# Altium project PLD.PrjPcb
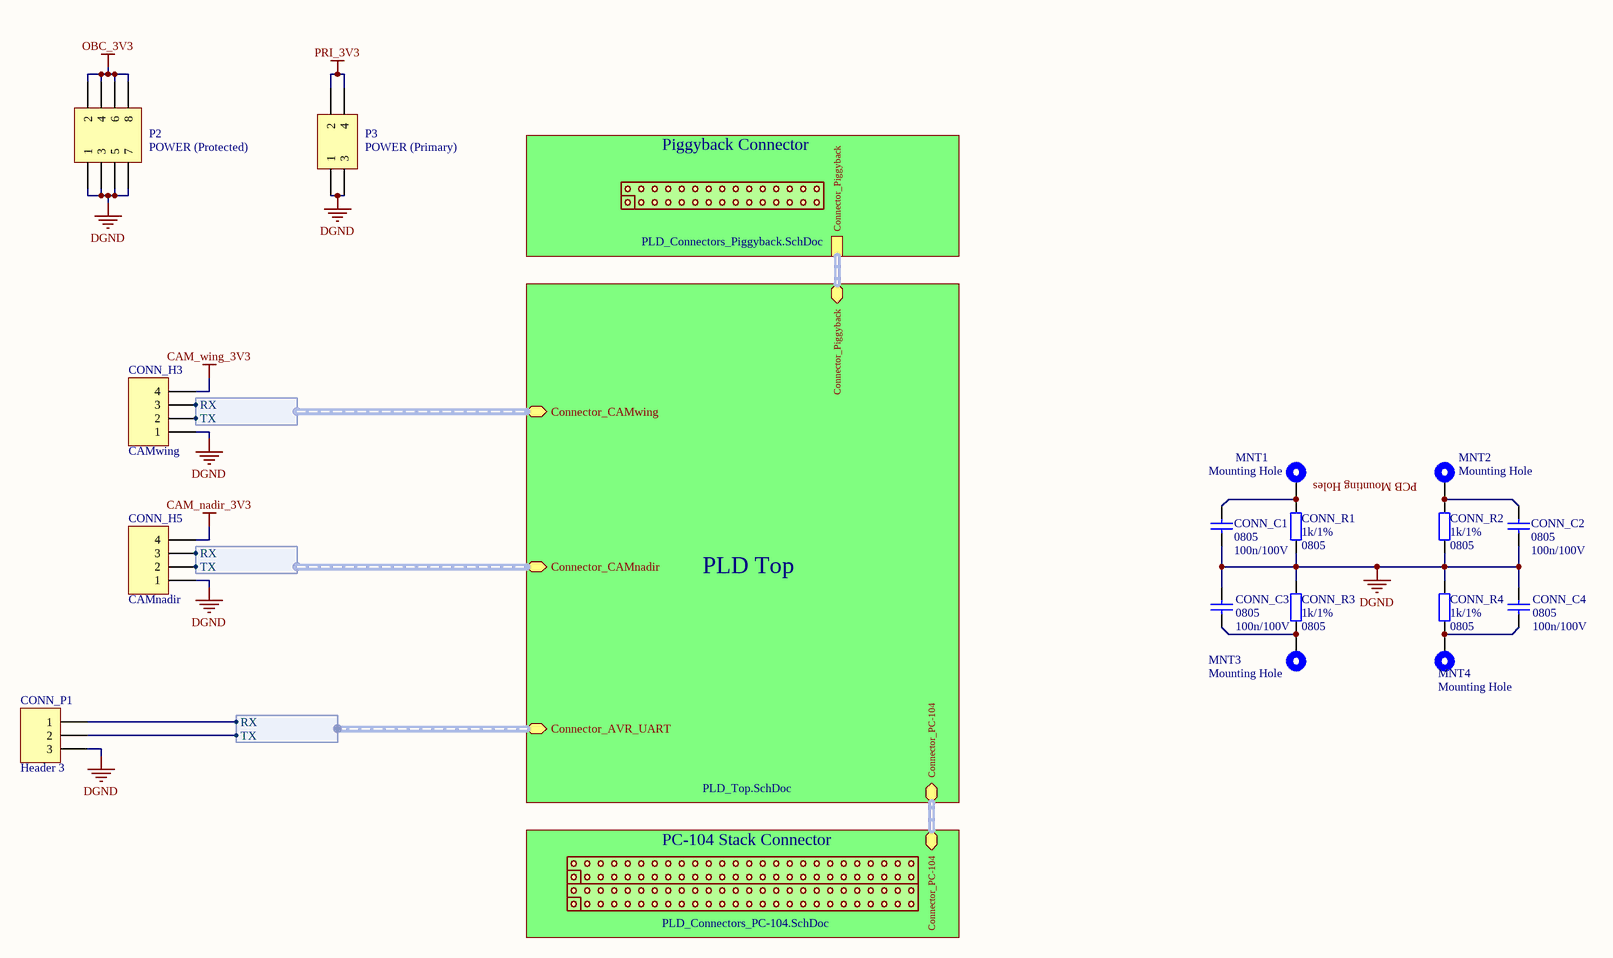
[diagram p0: PLD_Connectors.SchDoc]
ApprovedBy_Name: (not approved); Author_Name: M. Gumiela and  G. Gajoch; CheckedBy_Name: P. Kuligowski; Equipment: Main Board; Model: DM1; PCB_Author: (pcbdoc author); PCB_CheckedBy: (not checked); PCB_DocName: Main Board; PCB_DocNo: PWSat2-xxx-DW-xxx; PCB_Id: Main Board; PCB_Revision: 1; Project_FullName: PW-Sat2; Project_Id: PLD; Project_ShortName: PLD; Schematics_DocName: Main Board; Schematics_DocNo: PWSat2-xxx-DW-xxx; Schematics_Revision: 1; Subsystem: PLD
13 sheets, 154 parts. Net scope: hierarchical (ports join the sheet entries above them; power ports are global).
Board file: PLD.PcbDoc
Sheets:
  PLD_Connectors.SchDoc
    PLD Top = PLD_Top.SchDoc
      RTC = PLD_RTC.SchDoc
      AVR interface = AVR.SchDoc
      UART-Buffer&MUX for CAMs = PLD_CAM_MUX.SchDoc
      Gyroscopes = PLD_Gyroscopes.SchDoc
      Local Supply = PLD_Local-Supply.SchDoc
      Flash Memory 3 = PLD_Flash-Memory.SchDoc
      I2C Repeater for RTC + Gyro = PLD_I2C-Repeater.SchDoc
      FRAM Memory 1 = PLD_FRAM-Memory.SchDoc
      Flash Memory 2 = PLD_Flash-Memory.SchDoc
      Flash Memory 1 = PLD_Flash-Memory.SchDoc
      FRAM Memory 2 = PLD_FRAM-Memory.SchDoc
      FRAM Memory 3 = PLD_FRAM-Memory.SchDoc
      I2C_SW_Gyro = PLD_I2C_Switch.SchDoc
      I2C_SW_RTC = PLD_I2C_Switch.SchDoc
      I2C_SW_AVR = PLD_I2C_Switch.SchDoc
    PC-104 Stack Connector = PLD_Connectors_PC-104.SchDoc
    Piggyback Connector = PLD_Connectors_Piggyback.SchDoc

## Sheet PLD_Connectors.SchDoc: Connectors
size A3; ApprovedBy: Piotr Kuligowski; CheckedBy: Piotr Kuligowski; Author: Michał Gumiela; DocumentNumber: PWSat2-xxx-DW-xxx; Revision: 1; SheetNumber: 1; SheetTotal: 13; Model: DM1

### Parts
CONN_C1  Package: 0805  [SMD_Capacitor_0805]  (hidden comment: 100n/100V)
CONN_C2  Package: 0805  [SMD_Capacitor_0805]  (hidden comment: 100n/100V)
CONN_C3  Package: 0805  [SMD_Capacitor_0805]  (hidden comment: 100n/100V)
CONN_C4  Package: 0805  [SMD_Capacitor_0805]  (hidden comment: 100n/100V)
CONN_H3  CAMwing  [HEADER 1X4H Male]
CONN_H5  CAMnadir  [HEADER 1X4H Male]
CONN_P1  Header 3  [HEADER1X3H Male]
CONN_R1  Package: 0805  [SMD_Resistor_0805]  (hidden comment: 1k/1%)
CONN_R2  Package: 0805  [SMD_Resistor_0805]  (hidden comment: 1k/1%)
CONN_R3  Package: 0805  [SMD_Resistor_0805]  (hidden comment: 1k/1%)
CONN_R4  Package: 0805  [SMD_Resistor_0805]  (hidden comment: 1k/1%)
MNT1  Mounting Hole  [PC-104_PcbMntHole_M3]
MNT2  Mounting Hole  [PC-104_PcbMntHole_M3]
MNT3  Mounting Hole  [PC-104_PcbMntHole_M3]
MNT4  Mounting Hole  [PC-104_PcbMntHole_M3]
P2  POWER (Protected)  [HEADER 2X4 MALE]
P3  POWER (Primary)  [HDR2X2]

### Sub-sheets
PC-104 Stack Connector = PLD_Connectors_PC-104.SchDoc: Connector_PC-104 (harness Connector_PC-104)
Piggyback Connector = PLD_Connectors_Piggyback.SchDoc: Connector_Piggyback (harness Connector_Piggyback)
PLD Top = PLD_Top.SchDoc: Connector_PC-104 (harness Connector_PC-104), Connector_Piggyback (harness Connector_Piggyback), Connector_CAMnadir (harness CAM), Connector_CAMwing (harness CAM), Connector_AVR_UART (harness UART)

### Harnesses
CAM: TX, RX
UART: TX, RX

### Nets
CAM_nadir_3V3: CONN_H5.4
CAM_wing_3V3: CONN_H3.4
DGND: CONN_C1.1 CONN_C2.1 CONN_C3.2 CONN_C4.2 CONN_H3.1 CONN_H5.1 CONN_P1.3 CONN_R1.1 CONN_R2.1 CONN_R3.2 CONN_R4.2 P2.1 P2.3 P2.5 P2.7 P3.1 P3.3
OBC_3V3: P2.2 P2.4 P2.6 P2.8
PRI_3V3: P3.2 P3.4
NetCONN_C1_2: CONN_C1.2 CONN_R1.2 MNT1.1
NetCONN_C2_2: CONN_C2.2 CONN_R2.2 MNT2.1
NetCONN_C3_1: CONN_C3.1 CONN_R3.1 MNT3.1
NetCONN_C4_1: CONN_C4.1 CONN_R4.1 MNT4.1
NetCONN_H3_2: CONN_H3.2 ; sheet PLD Top/Connector_CAMwing.TX
NetCONN_H3_3: CONN_H3.3 ; sheet PLD Top/Connector_CAMwing.RX
NetCONN_H5_2: CONN_H5.2 ; sheet PLD Top/Connector_CAMnadir.TX
NetCONN_H5_3: CONN_H5.3 ; sheet PLD Top/Connector_CAMnadir.RX
NetCONN_P1_1: CONN_P1.1 ; sheet PLD Top/Connector_AVR_UART.RX
NetCONN_P1_2: CONN_P1.2 ; sheet PLD Top/Connector_AVR_UART.TX

### Buses and harness runs
harness sheet PC-104 Stack Connector/Connector_PC-104 = sheet PLD Top/Connector_PC-104
harness sheet Piggyback Connector/Connector_Piggyback = sheet PLD Top/Connector_Piggyback

### Notes on the sheet
- (near MNT1) PCB Mounting Holes
- Title:
- Project:
- Author:
- Model:
- Document Number:
- Checked by:
- Rev:
- Date:
- Approved by:
- Sheet:
- of
- File name:

### Library data of the parts
CONN_C1-CONN_C4 = Cer_C0805T104K1RCLTU: Ceramic Cap Kemet COTS 100n/100V X7R 0805; ManufacturerPartNumber: C0805T104K1RCLTU; Manufacturer: Kemet; Value: 100n/100V
CONN_H3 CONN_H5 = Header 4: Header, 4-Pin; LatestRevisionDate: 17-Jul-2002; LatestRevisionNote: Re-released for DXP Platform.; Publisher: Altium Limited
CONN_P1 = Header 3: Header, 3-Pin; LatestRevisionDate: 17-Jul-2002; LatestRevisionNote: Re-released for DXP Platform.; Publisher: Altium Limited
CONN_R1-CONN_R4 = CRCW08051K00FKxxxx: 1k/1% Vishay CRCW 0805 Resistor. 125mW, 100ppm, 150V.; Manufacturer: Vishay; ManufacturerPartNumber: CRCW08051K00FKxxxx; Value: 1k/1%
MNT1-MNT4 = MntHole: PCB Mounting Hole; Value: Mounting Hole
P2 = Header 4X2: Header, 4-Pin, Dual row; LatestRevisionDate: 17-Jul-2002; LatestRevisionNote: Re-released for DXP Platform.; Publisher: Altium Limited
P3 = Header 2X2: Header, 2-Pin, Dual row; LatestRevisionDate: 17-Jul-2002; LatestRevisionNote: Re-released for DXP Platform.; Publisher: Altium Limited

## Sheet PLD_Top.SchDoc: Top
size A4; ApprovedBy: Piotr Kuligowski; CheckedBy: Piotr Kuligowski; Author: Michał Gumiela; DocumentNumber: PWSat2-xxx-DW-xxx; Revision: 1; SheetNumber: 4; SheetTotal: 13; Model: DM1
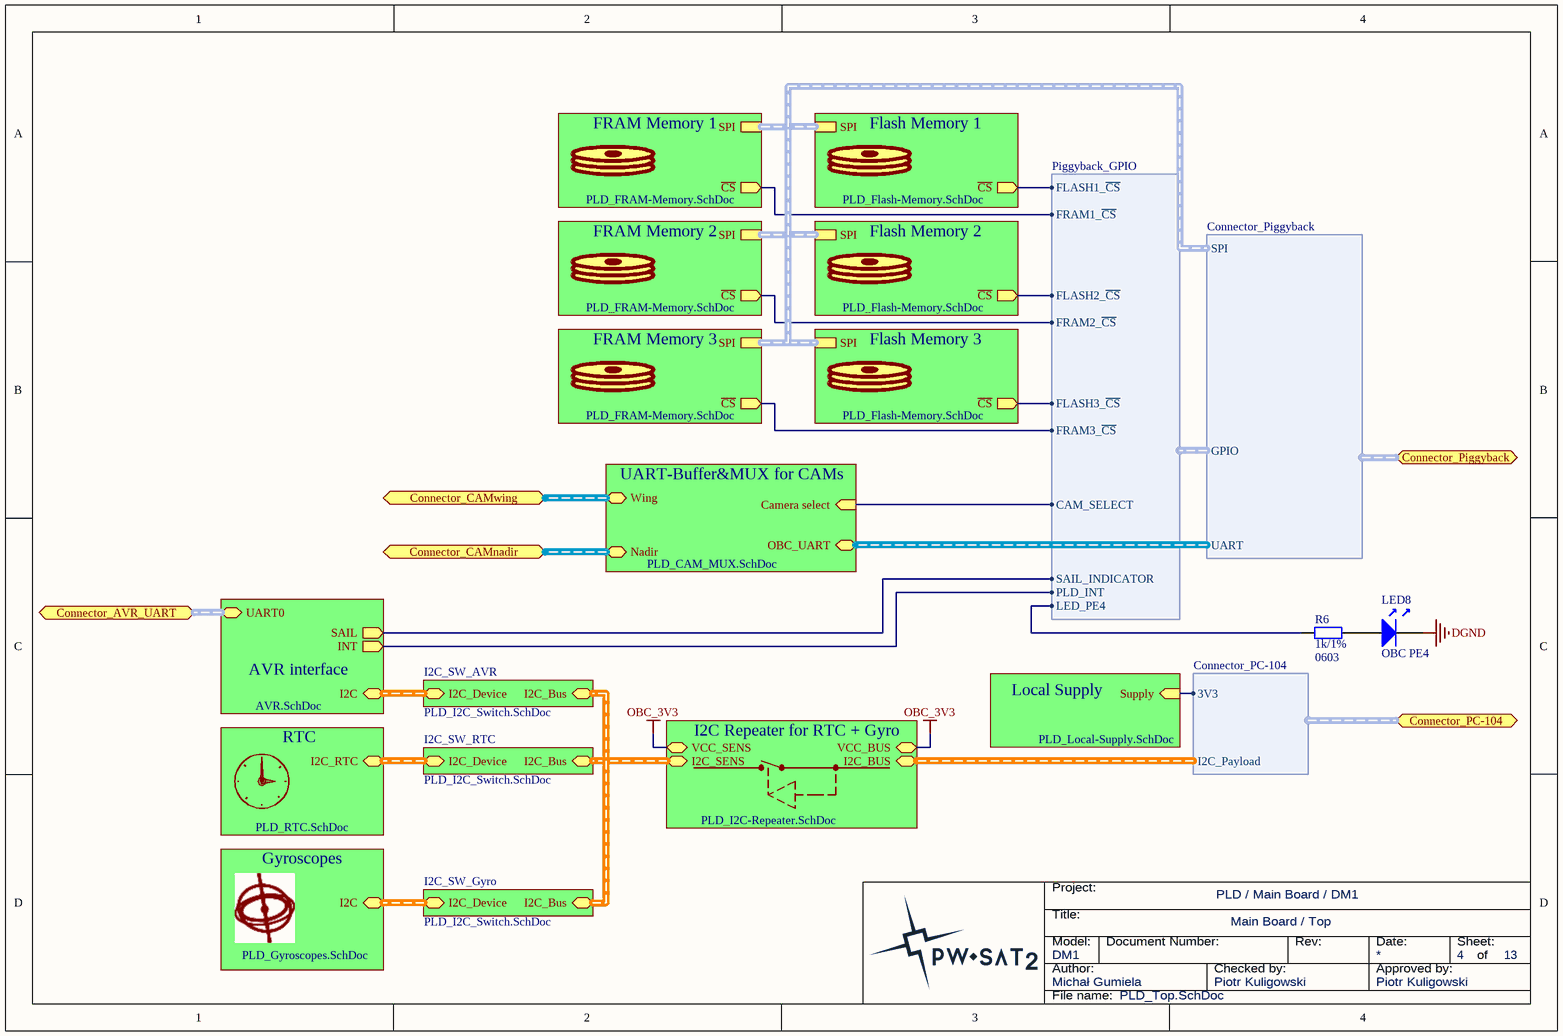
[diagram p1: PLD_Top.SchDoc]

### Parts
LED8  OBC PE4  [SMD_LED_1206]
R6  Package: 0603  [SMD_Resistor_0603]  (hidden comment: 1k/1%)

### Sub-sheets
AVR interface = AVR.SchDoc: I2C (harness I2C), INT (out), SAIL (out), UART0 (harness UART)
Flash Memory 1 = PLD_Flash-Memory.SchDoc: SPI (harness SPI), ~{CS} (out)
Flash Memory 2 = PLD_Flash-Memory.SchDoc: SPI (harness SPI), ~{CS} (out)
Flash Memory 3 = PLD_Flash-Memory.SchDoc: SPI (harness SPI), ~{CS} (out)
FRAM Memory 1 = PLD_FRAM-Memory.SchDoc: SPI (harness SPI), ~{CS} (out)
FRAM Memory 2 = PLD_FRAM-Memory.SchDoc: SPI (harness SPI), ~{CS} (out)
FRAM Memory 3 = PLD_FRAM-Memory.SchDoc: SPI (harness SPI), ~{CS} (out)
Gyroscopes = PLD_Gyroscopes.SchDoc: I2C (harness I2C)
I2C Repeater for RTC + Gyro = PLD_I2C-Repeater.SchDoc: I2C_BUS (harness I2C), VCC_SENS, VCC_BUS, I2C_SENS (harness I2C)
I2C_SW_AVR = PLD_I2C_Switch.SchDoc: I2C_Device (harness I2C), I2C_Bus (harness I2C)
I2C_SW_Gyro = PLD_I2C_Switch.SchDoc: I2C_Device (harness I2C), I2C_Bus (harness I2C)
I2C_SW_RTC = PLD_I2C_Switch.SchDoc: I2C_Device (harness I2C), I2C_Bus (harness I2C)
Local Supply = PLD_Local-Supply.SchDoc: Supply (in)
RTC = PLD_RTC.SchDoc: I2C_RTC (harness I2C)
UART-Buffer&MUX for CAMs = PLD_CAM_MUX.SchDoc: Camera select (in), OBC_UART (harness UART), Wing (harness CAM), Nadir (harness CAM)

### Ports
Connector_AVR_UART (harness UART), Connector_CAMnadir (harness Connector_CAM), Connector_CAMwing (harness Connector_CAM), Connector_PC-104 (harness Connector_PC-104), Connector_Piggyback (harness Connector_Piggyback)

### Harnesses
Connector_PC-104: I2C_Payload, 3V3
Connector_Piggyback: SPI, UART, GPIO
Piggyback_GPIO: CAM_SELECT, FLASH1_~{CS}, FRAM1_~{CS}, PLD_INT, FLASH2_~{CS}, FLASH3_~{CS}, FRAM2_~{CS}, FRAM3_~{CS}, SAIL_INDICATOR, LED_PE4

### Nets
DGND: LED8.K
OBC_3V3: sheet I2C Repeater for RTC + Gyro/VCC_SENS, sheet I2C Repeater for RTC + Gyro/VCC_BUS
INT: sheet AVR interface/INT, harness Piggyback_GPIO.PLD_INT
PC-104_Supply_OBC+3V3: sheet Local Supply/Supply, port Connector_PC-104.3V3
Piggyback_ADC_PD4: sheet AVR interface/SAIL, harness Piggyback_GPIO.SAIL_INDICATOR
Piggyback_GPIO_PA8: sheet Flash Memory 1/~{CS}, harness Piggyback_GPIO.FLASH1_~{CS}
Piggyback_GPIO_PA9: sheet Flash Memory 2/~{CS}, harness Piggyback_GPIO.FLASH2_~{CS}
Piggyback_GPIO_PA10: sheet Flash Memory 3/~{CS}, harness Piggyback_GPIO.FLASH3_~{CS}
Piggyback_GPIO_PA11: sheet FRAM Memory 1/~{CS}, harness Piggyback_GPIO.FRAM1_~{CS}
Piggyback_GPIO_PA12: sheet FRAM Memory 2/~{CS}, harness Piggyback_GPIO.FRAM2_~{CS}
Piggyback_GPIO_PA13: sheet FRAM Memory 3/~{CS}, harness Piggyback_GPIO.FRAM3_~{CS}
Piggyback_GPIO_PB12: sheet UART-Buffer&MUX for CAMs/Camera select, harness Piggyback_GPIO.CAM_SELECT
Piggyback_SPI-CS_PE4: R6.1 ; harness Piggyback_GPIO.LED_PE4
NetLED8_A: LED8.A R6.2

### Buses and harness runs
harness port Connector_AVR_UART = sheet AVR interface/UART0
harness port Connector_CAMnadir = sheet UART-Buffer&MUX for CAMs/Nadir
harness port Connector_CAMwing = sheet UART-Buffer&MUX for CAMs/Wing
harness sheet AVR interface/I2C = sheet I2C_SW_AVR/I2C_Device
harness sheet Flash Memory 1/SPI = sheet Flash Memory 2/SPI = sheet Flash Memory 3/SPI = sheet FRAM Memory 1/SPI = sheet FRAM Memory 2/SPI = sheet FRAM Memory 3/SPI
harness sheet Gyroscopes/I2C = sheet I2C_SW_Gyro/I2C_Device
harness sheet I2C Repeater for RTC + Gyro/I2C_SENS = sheet I2C_SW_AVR/I2C_Bus = sheet I2C_SW_Gyro/I2C_Bus = sheet I2C_SW_RTC/I2C_Bus
harness sheet I2C_SW_RTC/I2C_Device = sheet RTC/I2C_RTC

### Notes on the sheet
- Title:
- Project:
- Author:
- Model:
- Document Number:
- Checked by:
- Rev:
- Date:
- Approved by:
- Sheet:
- of
- File name:

### Library data of the parts
LED8 = LED-1206_RED: LED diode, SMD1206 package.; Value: OBC PE4; Supplier 1: Farnell; Farnell: 1581229
R6 = CRCW06031K00FKxxxx: 1k/1% Vishay CRCW 0603 Resistor. 100mW, 100ppm, 75V.; Manufacturer: Vishay; ManufacturerPartNumber: CRCW06031K00FKxxxx; Value: 1k/1%

## Sheet PLD_RTC.SchDoc: RTC
size A4; ApprovedBy: Piotr Kuligowski; CheckedBy: Piotr Kuligowski; Author: Michał Gumiela; DocumentNumber: PWSat2-xxx-DW-xxx; Revision: 1; SheetNumber: 11; SheetTotal: 13; Model: DM1
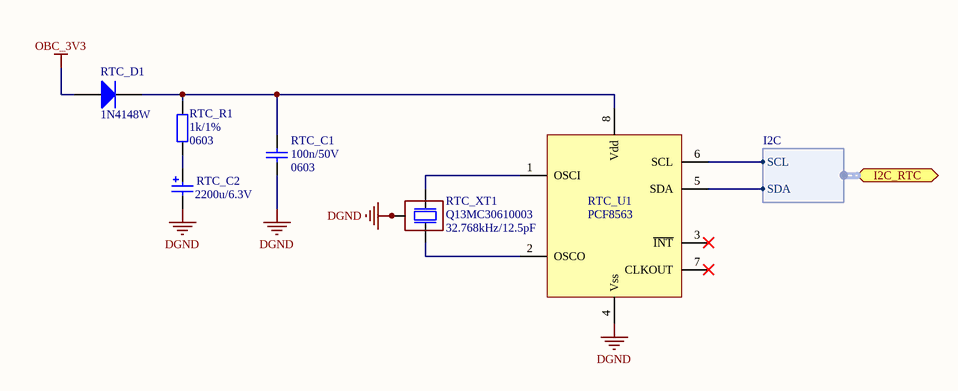
[diagram p2: PLD_RTC.SchDoc]

### Parts
RTC_C1  Package: 0603  [SMD_Capacitor_0603]  (hidden comment: 100n/50V)
RTC_C2  2200u/6.3V  [Tant_592D_X]
RTC_D1  1N4148W  [SOD-123]
RTC_R1  Package: 0603  [SMD_Resistor_0603]  (hidden comment: 1k/1%)
RTC_U1  (no value)  [TSSOP8_L]
RTC_XT1  32.768kHz/12.5pF  [Epson_MC-306]

### Ports
I2C_RTC (harness I2C)

### Harnesses
I2C: SDA, SCL

### Nets
DGND: RTC_C1.2 RTC_C2.2 RTC_U1.4(Vss) RTC_XT1.2(NC) RTC_XT1.3(NC)
OBC_3V3: RTC_D1.A
NetI2C_SW_R1_I2C_SW_RTC_2: RTC_U1.5(SDA) ; port I2C_RTC.SDA
NetI2C_SW_R2_I2C_SW_RTC_2: RTC_U1.6(SCL) ; port I2C_RTC.SCL
NetRTC_C1_1: RTC_C1.1 RTC_D1.K RTC_R1.1 RTC_U1.8(Vdd)
NetRTC_C2_1: RTC_C2.1 RTC_R1.2
NetRTC_U1_1: RTC_U1.1(OSCI) RTC_XT1.1(inp)
NetRTC_U1_2: RTC_U1.2(OSCO) RTC_XT1.4(out)

Not connected (* = marked no-connect by the designer): RTC_U1 3(~{INT})* 7(CLKOUT)*

### Notes on the sheet
- Title:
- Project:
- Author:
- Model:
- Document Number:
- Checked by:
- Rev:
- Date:
- Approved by:
- Sheet:
- of
- File name:

### Library data of the parts
RTC_C1 = Cer_C0603T104K5RALTU: Ceramic Cap Kemet COTS 100n/50V X7R 0603; Manufacturer: Kemet; ManufacturerPartNumber: C0603T104K5RALTU; Value: 100n/50V
RTC_C2 = Tant_592D228X96R3X2T20H: Vishay 592D Solid Tantalum Chip Capacitors.; ManufacturerPartNumber: 592D228X96R3X2T20H; Manufacturer: Vishay; Value: 2200u/6.3V
RTC_D1 = 1N4148W: Small Signal Fast Switching Diode; Manufacturer: Vishay; Value: 1N4148W
RTC_R1 = CRCW06031K00FKxxxx: as R6 on sheet PLD_Top; Manufacturer: Vishay; ManufacturerPartNumber: CRCW06031K00FKxxxx; Value: 1k/1%
RTC_U1 = PCF8563: Real-time clock/calendar; Manufacturer: NXP; HelpUrl: http://www.nxp.com/documents/data_sheet/PCF8563.pdf; ManufacturerPartNumber: PCF8563
RTC_XT1 = Q13MC30610003: EPSON MC-306 32.768KHZ 12.5pF Crystal; Manufacturer: Epson; ManufacturerPartNumber: Q13MC30610003; Value: 32.768kHz/12.5pF

## Sheet AVR.SchDoc: Gyroscopes Buffer
size A4; ApprovedBy: Piotr Kuligowski; CheckedBy: Piotr Kuligowski; Author: Michał Gumiela; DocumentNumber: PWSat2-xxx-DW-xxx; Revision: 1; SheetNumber: 10; SheetTotal: 13; Model: DM1
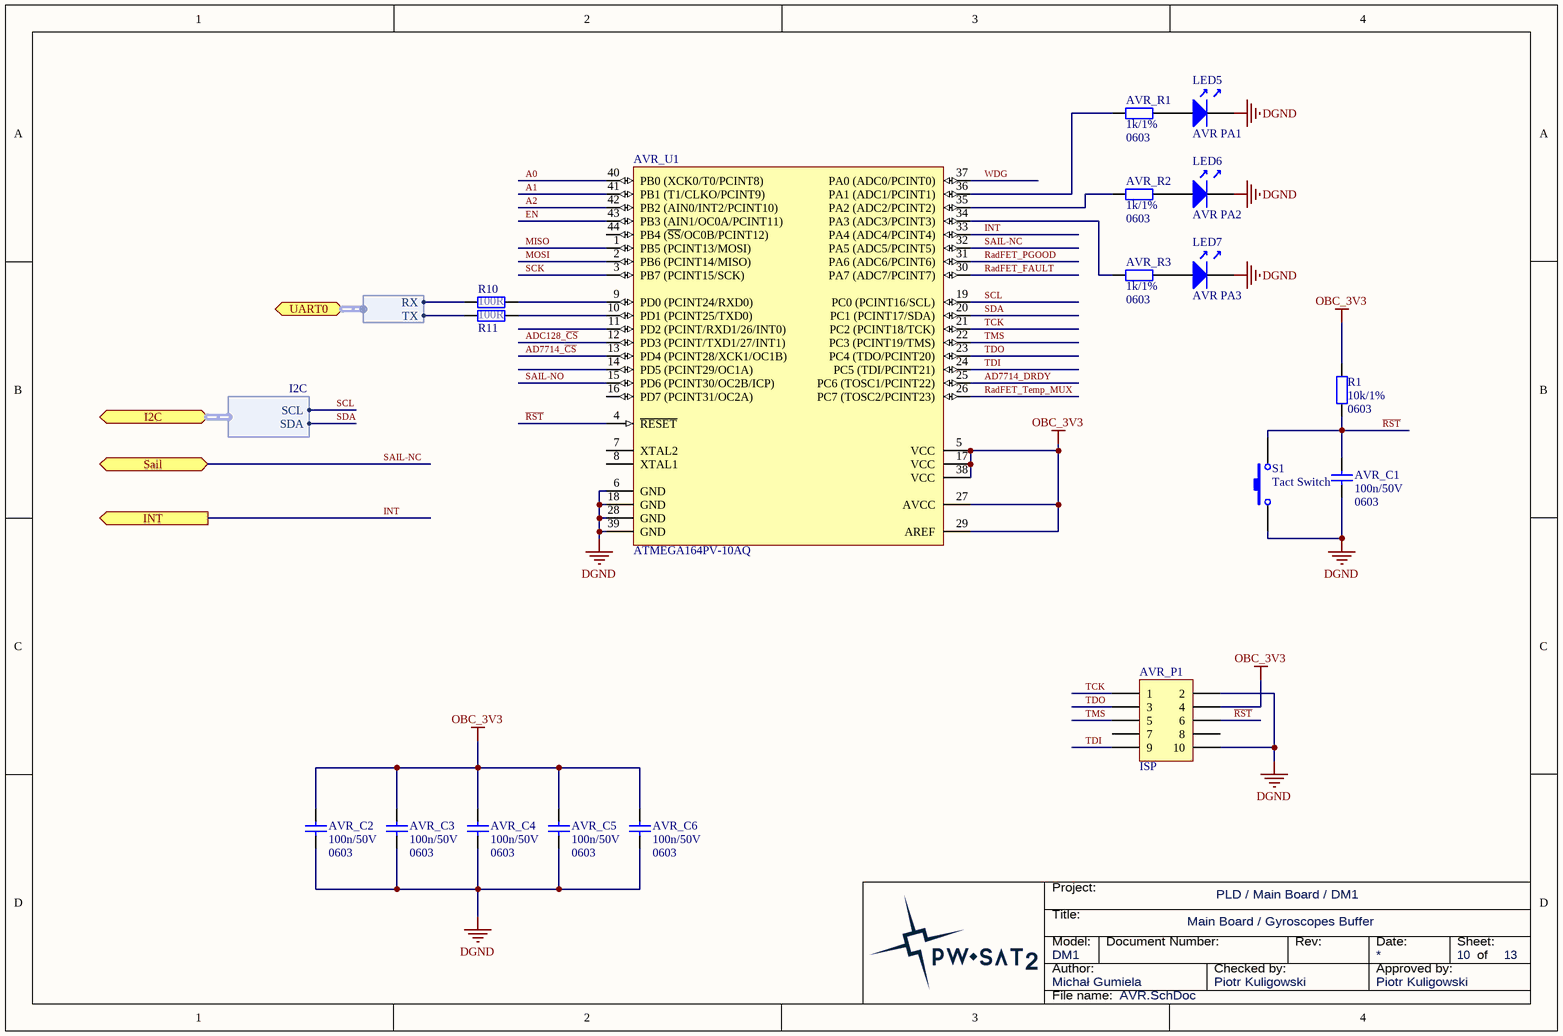
[diagram p3: AVR.SchDoc]

### Parts
AVR_C1  Package: 0603  [SMD_Capacitor_0603]  (hidden comment: 100n/50V)
AVR_C2  Package: 0603  [SMD_Capacitor_0603]  (hidden comment: 100n/50V)
AVR_C3  Package: 0603  [SMD_Capacitor_0603]  (hidden comment: 100n/50V)
AVR_C4  Package: 0603  [SMD_Capacitor_0603]  (hidden comment: 100n/50V)
AVR_C5  Package: 0603  [SMD_Capacitor_0603]  (hidden comment: 100n/50V)
AVR_C6  Package: 0603  [SMD_Capacitor_0603]  (hidden comment: 100n/50V)
AVR_P1  ISP  [IDC-10-Male-Socket]
AVR_R1  Package: 0603  [SMD_Resistor_0603]  (hidden comment: 1k/1%)
AVR_R2  Package: 0603  [SMD_Resistor_0603]  (hidden comment: 1k/1%)
AVR_R3  Package: 0603  [SMD_Resistor_0603]  (hidden comment: 1k/1%)
AVR_U1  ATMEGA164PV-10AQ  [TQFP-44]
LED5  AVR PA1  [SMD_LED_1206]
LED6  AVR PA2  [SMD_LED_1206]
LED7  AVR PA3  [SMD_LED_1206]
R1  Package: 0603  [SMD_Resistor_0603]  (hidden comment: 10k/1%)
R10  100R  [SMD_Resistor_0603]
R11  100R  [SMD_Resistor_0603]
S1  Tact Switch  [Tact Switch 3x6]

### Ports
I2C (harness I2C), INT (out), Sail, UART0 (harness UART)

### Harnesses
I2C: SDA, SCL
UART: TX, RX

### Nets
DGND: AVR_C1.2 AVR_C2.2 AVR_C3.2 AVR_C4.2 AVR_C5.2 AVR_C6.2 AVR_P1.2 AVR_P1.10 AVR_U1.6(GND) AVR_U1.18(GND) AVR_U1.28(GND) AVR_U1.39(GND) LED5.K LED6.K LED7.K S1.2
OBC_3V3: AVR_C2.1 AVR_C3.1 AVR_C4.1 AVR_C5.1 AVR_C6.1 AVR_P1.4 AVR_U1.5(VCC) AVR_U1.17(VCC) AVR_U1.27(AVCC) AVR_U1.29(AREF) AVR_U1.38(VCC) R1.1
A0: AVR_U1.40(PB0_(XCK0/T0/PCINT8))
A1: AVR_U1.41(PB1_(T1/CLKO/PCINT9))
A2: AVR_U1.42(PB2_(AIN0/INT2/PCINT10))
AD7714_~{CS}: AVR_U1.13(PD4_(PCINT28/XCK1/OC1B))
AD7714_DRDY: AVR_U1.25(PC6_(TOSC1/PCINT22))
ADC128_~{CS}: AVR_U1.12(PD3_(PCINT/TXD1/27/INT1))
EN: AVR_U1.43(PB3_(AIN1/OC0A/PCINT11))
INT: AVR_U1.33(PA4_(ADC4/PCINT4)) ; port INT
MISO: AVR_U1.1(PB5_(PCINT13/MOSI))
MOSI: AVR_U1.2(PB6_(PCINT14/MISO))
~{RST}: AVR_C1.1 AVR_P1.6 AVR_U1.4(~{RESET}) R1.2 S1.1
RadFET_FAULT: AVR_U1.30(PA7_(ADC7/PCINT7))
RadFET_PGOOD: AVR_U1.31(PA6_(ADC6/PCINT6))
RadFET_Temp_MUX: AVR_U1.26(PC7_(TOSC2/PCINT23))
SAIL-NC: AVR_U1.32(PA5_(ADC5/PCINT5)) ; port Sail  [project net Piggyback_ADC_PD4]
SAIL-NO: AVR_U1.15(PD6_(PCINT30/OC2B/ICP))
SCK: AVR_U1.3(PB7_(PCINT15/SCK))
SCL: AVR_U1.19(PC0_(PCINT16/SCL)) ; port I2C.SCL
SDA: AVR_U1.20(PC1_(PCINT17/SDA)) ; port I2C.SDA
TCK: AVR_P1.1 AVR_U1.21(PC2_(PCINT18/TCK))
TDI: AVR_P1.9 AVR_U1.24(PC5_(TDI/PCINT21))
TDO: AVR_P1.3 AVR_U1.23(PC4_(TDO/PCINT20))
TMS: AVR_P1.5 AVR_U1.22(PC3_(PCINT19/TMS))
WDG: AVR_U1.37(PA0_(ADC0/PCINT0))
NetAVR_R1_1: AVR_R1.1 AVR_U1.36(PA1_(ADC1/PCINT1))
NetAVR_R1_2: AVR_R1.2 LED5.A
NetAVR_R2_1: AVR_R2.1 AVR_U1.35(PA2_(ADC2/PCINT2))
NetAVR_R2_2: AVR_R2.2 LED6.A
NetAVR_R3_1: AVR_R3.1 AVR_U1.34(PA3_(ADC3/PCINT3))
NetAVR_R3_2: AVR_R3.2 LED7.A
NetAVR_U1_9: AVR_U1.9(PD0_(PCINT24/RXD0)) R10.2
NetAVR_U1_10: AVR_U1.10(PD1_(PCINT25/TXD0)) R11.2
NetCONN_P1_1: R10.1 ; port UART0.RX
NetCONN_P1_2: R11.1 ; port UART0.TX

Not connected (* = marked no-connect by the designer): AVR_P1 7 8; AVR_U1 7(XTAL2) 8(XTAL1) 11(PD2_(PCINT/RXD1/26/INT0)) 14(PD5_(PCINT29/OC1A)) 16(PD7_(PCINT31/OC2A)) 44(PB4_(~{SS}/OC0B/PCINT12))

### Notes on the sheet
- Title:
- Project:
- Author:
- Model:
- Document Number:
- Checked by:
- Rev:
- Date:
- Approved by:
- Sheet:
- of
- File name:

### Library data of the parts
AVR_C1-AVR_C6 = Cer_C0603T104K5RALTU: Ceramic Cap Kemet COTS 100n/50V X7R 0603; Manufacturer: Kemet; ManufacturerPartNumber: C0603T104K5RALTU; Value: 100n/50V
AVR_P1 = Header 5X2: Header, 5-Pin, Dual row
AVR_R1-AVR_R3 = CRCW06031K00FKxxxx: as R6 on sheet PLD_Top; Manufacturer: Vishay; ManufacturerPartNumber: CRCW06031K00FKxxxx; Value: 1k/1%
AVR_U1 = ATMEGA164PV-10AQ: General-purpose microcontroller; Value: ATMEGA164PV-10AQ
LED5-LED7 = LED-1206_RED: LED diode, SMD1206 package.; Supplier 1: Farnell; Farnell: 1581229
  LED5: Value: AVR PA1
  LED6: Value: AVR PA2
  LED7: Value: AVR PA3
R1 R10 R11 = CRCW060310K0FKxxxx: 10k/1% Vishay CRCW 0603 Resistor. 100mW, 100ppm, 75V.; Manufacturer: Vishay; ManufacturerPartNumber: CRCW060310K0FKxxxx
  R1: Value: 10k/1%
  R10 R11: Value: 100R; Package: 0603
S1 = TactSwitch: Supplier 1: Farnell

## Sheet PLD_CAM_MUX.SchDoc: CAMs UART-Buffer
size A4; ApprovedBy: Piotr Kuligowski; CheckedBy: Piotr Kuligowski; Author: Michał Gumiela; DocumentNumber: PWSat2-xxx-DW-xxx; Revision: 1; SheetNumber: 9; SheetTotal: 13; Model: DM1
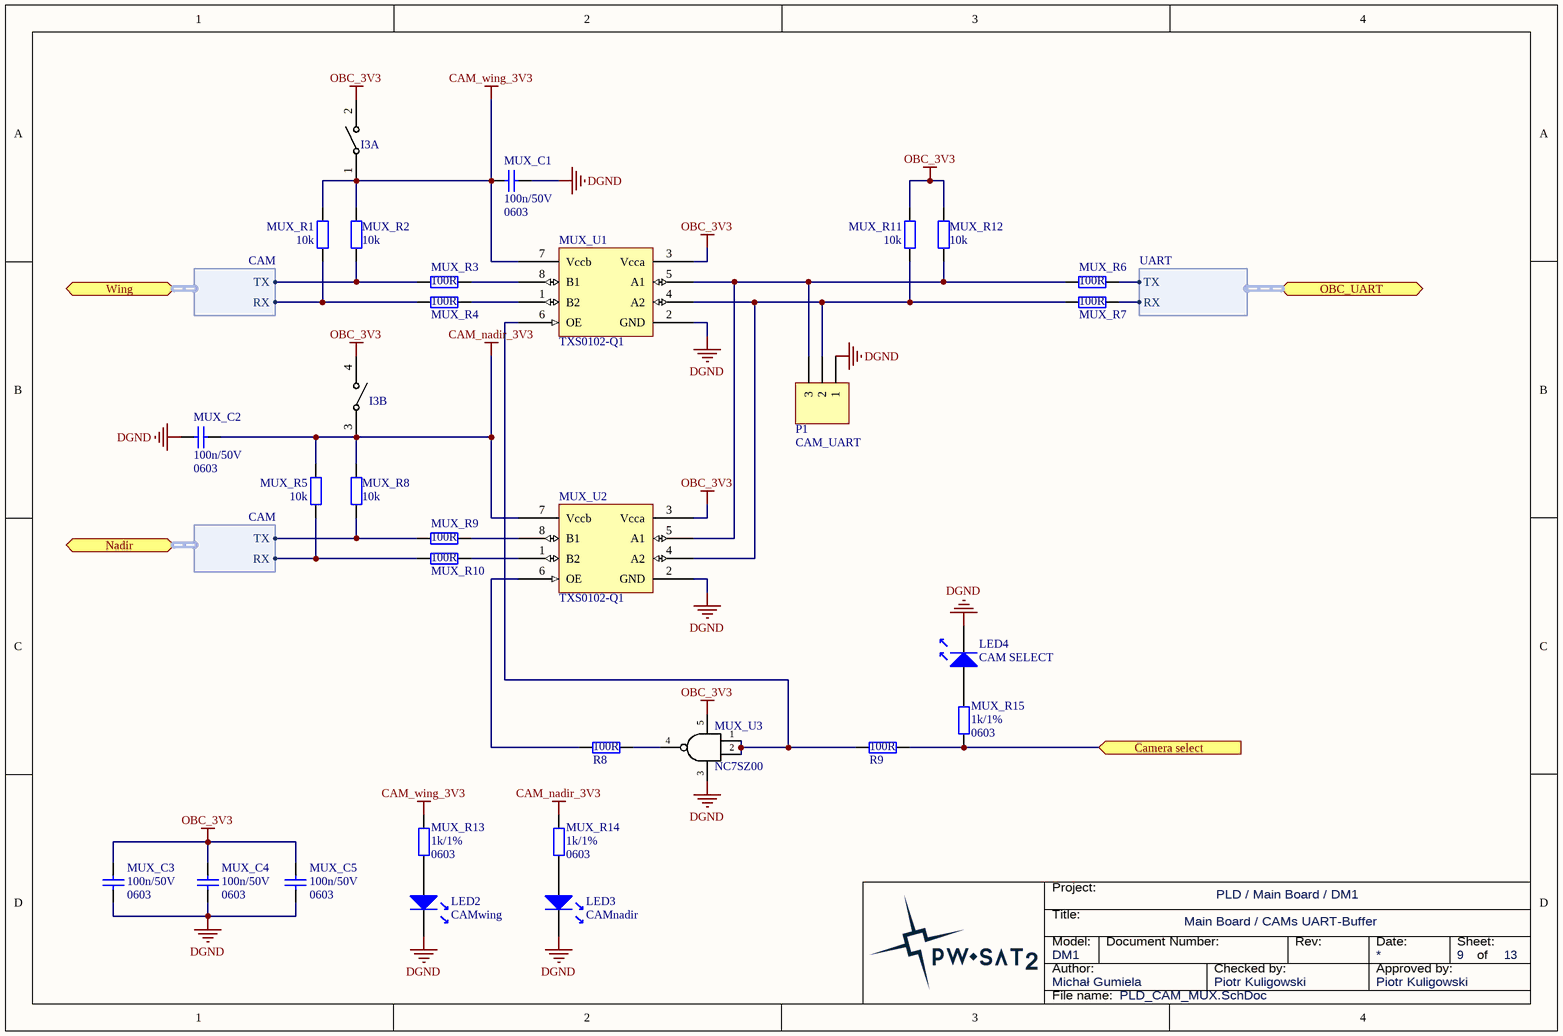
[diagram p4: PLD_CAM_MUX.SchDoc]

### Parts
I3  MCEPM-02  [MCEPM-02]  (value not drawn)  (parts A,B of 2)
LED2  CAMwing  [SMD_LED_1206]
LED3  CAMnadir  [SMD_LED_1206]
LED4  CAM SELECT  [SMD_LED_1206]
MUX_C1  Package: 0603  [SMD_Capacitor_0603]  (hidden comment: 100n/50V)
MUX_C2  Package: 0603  [SMD_Capacitor_0603]  (hidden comment: 100n/50V)
MUX_C3  Package: 0603  [SMD_Capacitor_0603]  (hidden comment: 100n/50V)
MUX_C4  Package: 0603  [SMD_Capacitor_0603]  (hidden comment: 100n/50V)
MUX_C5  Package: 0603  [SMD_Capacitor_0603]  (hidden comment: 100n/50V)
MUX_R1  10k  [SMD_Resistor_0603]
MUX_R2  10k  [SMD_Resistor_0603]
MUX_R3  100R  [SMD_Resistor_0603]
MUX_R4  100R  [SMD_Resistor_0603]
MUX_R5  10k  [SMD_Resistor_0603]
MUX_R6  100R  [SMD_Resistor_0603]
MUX_R7  100R  [SMD_Resistor_0603]
MUX_R8  10k  [SMD_Resistor_0603]
MUX_R9  100R  [SMD_Resistor_0603]
MUX_R10  100R  [SMD_Resistor_0603]
MUX_R11  10k  [SMD_Resistor_0603]
MUX_R12  10k  [SMD_Resistor_0603]
MUX_R13  Package: 0603  [SMD_Resistor_0603]  (hidden comment: 1k/1%)
MUX_R14  Package: 0603  [SMD_Resistor_0603]  (hidden comment: 1k/1%)
MUX_R15  Package: 0603  [SMD_Resistor_0603]  (hidden comment: 1k/1%)
MUX_U1  TXS0102-Q1  [VSSOP-8]
MUX_U2  TXS0102-Q1  [VSSOP-8]
MUX_U3  NC7SZ00  [SOT23-5]
P1  CAM_UART  [HEADER 1X3 MALE]
R8  100R  [SMD_Resistor_0603]
R9  100R  [SMD_Resistor_0603]

### Ports
Camera select (in), Nadir (harness CAM), OBC_UART (harness UART), Wing (harness CAM)

### Harnesses
UART: RX, TX
CAM: TX, RX

### Nets
CAM_nadir_3V3: I3.3 MUX_C2.1 MUX_R5.2 MUX_R8.2 MUX_R14.1 MUX_U2.7(Vccb)
CAM_wing_3V3: I3.1 MUX_C1.1 MUX_R1.2 MUX_R2.2 MUX_R13.1 MUX_U1.7(Vccb)
DGND: LED2.K LED3.K LED4.K MUX_C1.2 MUX_C2.2 MUX_C3.2 MUX_C4.2 MUX_C5.2 MUX_U1.2(GND) MUX_U2.2(GND) MUX_U3.3(GND) P1.1
OBC_3V3: I3.2 I3.4 MUX_C3.1 MUX_C4.1 MUX_C5.1 MUX_R11.2 MUX_R12.2 MUX_U1.3(Vcca) MUX_U2.3(Vcca) MUX_U3.5(Vcc)
Piggyback_GPIO_PB12: MUX_R15.1 R9.2 ; port Camera select
Piggyback_UART-RX_PF7: MUX_R7.2 ; port OBC_UART.RX
Piggyback_UART-TX_PF6: MUX_R6.2 ; port OBC_UART.TX
NetCONN_H3_2: MUX_R2.1 MUX_R3.1 ; port Wing.TX
NetCONN_H3_3: MUX_R1.1 MUX_R4.1 ; port Wing.RX
NetCONN_H5_2: MUX_R8.1 MUX_R9.1 ; port Nadir.TX
NetCONN_H5_3: MUX_R5.1 MUX_R10.1 ; port Nadir.RX
NetLED2_A: LED2.A MUX_R13.2
NetLED3_A: LED3.A MUX_R14.2
NetLED4_A: LED4.A MUX_R15.2
NetMUX_R3_2: MUX_R3.2 MUX_U1.8(B1)
NetMUX_R4_2: MUX_R4.2 MUX_U1.1(B2)
NetMUX_R6_1: MUX_R6.1 MUX_R12.1 MUX_U1.5(A1) MUX_U2.5(A1) P1.3
NetMUX_R7_1: MUX_R7.1 MUX_R11.1 MUX_U1.4(A2) MUX_U2.4(A2) P1.2
NetMUX_R9_2: MUX_R9.2 MUX_U2.8(B1)
NetMUX_R10_2: MUX_R10.2 MUX_U2.1(B2)
NetMUX_U1_6: MUX_U1.6(OE) MUX_U3.1(A) MUX_U3.2(B) R9.1
NetMUX_U2_6: MUX_U2.6(OE) R8.1
NetMUX_U3_4: MUX_U3.4(Y) R8.2

### Notes on the sheet
- Title:
- Project:
- Author:
- Model:
- Document Number:
- Checked by:
- Rev:
- Date:
- Approved by:
- Sheet:
- of
- File name:

### Library data of the parts
LED2-LED4 = LED-1206_RED: LED diode, SMD1206 package.; Supplier 1: Farnell; Farnell: 1581229
  LED2: Value: CAMwing
  LED3: Value: CAMnadir
  LED4: Value: CAM SELECT
MUX_C1-MUX_C5 = Cer_C0603T104K5RALTU: Ceramic Cap Kemet COTS 100n/50V X7R 0603; Manufacturer: Kemet; ManufacturerPartNumber: C0603T104K5RALTU; Value: 100n/50V
MUX_R1-MUX_R12 R8 R9 = Res: Package: 0603
  MUX_R1 MUX_R2 MUX_R5 MUX_R8 MUX_R11 MUX_R12: Value: 10k
  MUX_R3 MUX_R4 MUX_R6 MUX_R7 MUX_R9 MUX_R10 R8 R9: Value: 100R
MUX_R13-MUX_R15 = CRCW06031K00FKxxxx: as R6 on sheet PLD_Top; Manufacturer: Vishay; ManufacturerPartNumber: CRCW06031K00FKxxxx; Value: 1k/1%
MUX_U1 MUX_U2 = TXS0102-Q1: 2-Bit Bidirectional Voltage-Level Translator  for Open-Drain and Push-Pull Applications; Manufacturer: Texas Instruments; Value: TXS0102-Q1; ComponentLink1URL: http://www.ti.com/lit/ds/symlink/txs0102-q1.pdf; ComponentLink1Description: Description; HelpURL: http://www.ti.com/lit/ds/symlink/txs0102-q1.pdf
MUX_U3 = NC7SZ00: TinyLogic UHS Two-Input NAND Gate.; Manufacturer: Fairchild Semiconductor; Value: NC7SZ00
P1 = Header 3: Header, 3-Pin; LatestRevisionDate: 17-Jul-2002; LatestRevisionNote: Re-released for DXP Platform.; Publisher: Altium Limited
I3 = MCEPM-02: Supplier 1: Farnell

## Sheet PLD_Gyroscopes.SchDoc: Gyroscopes
size A4; ApprovedBy: Piotr Kuligowski; CheckedBy: Piotr Kuligowski; Author: Michał Gumiela; DocumentNumber: PWSat2-xxx-DW-xxx; Revision: 1; SheetNumber: 6; SheetTotal: 13; Model: DM1
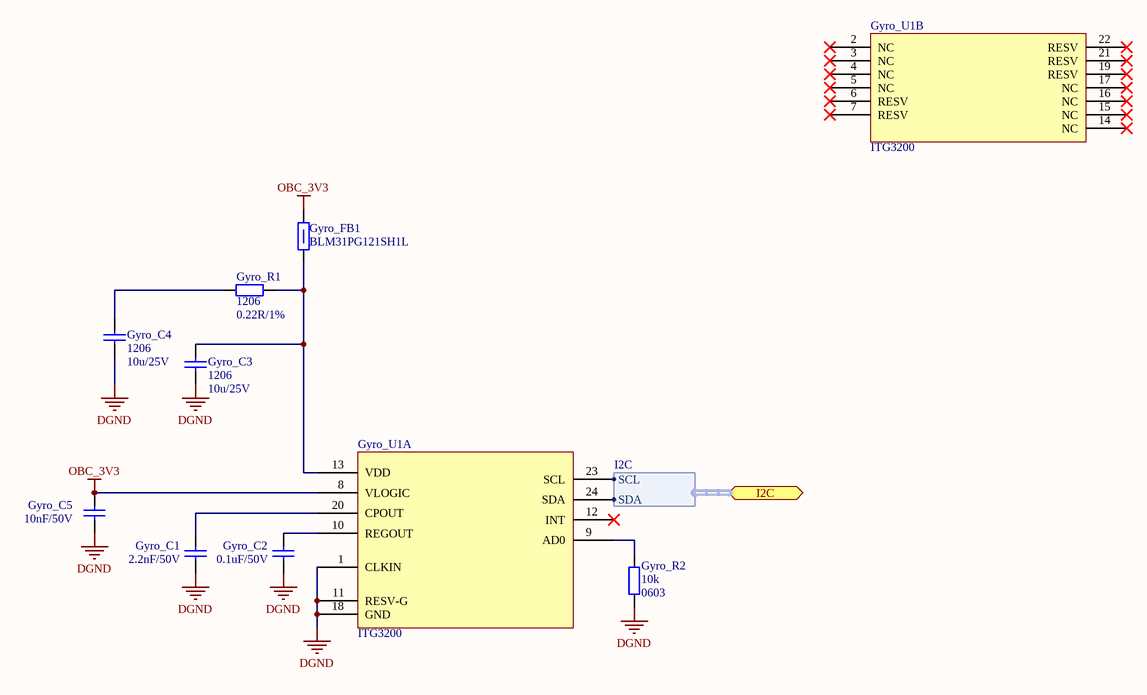
[diagram p5: PLD_Gyroscopes.SchDoc]

### Parts
Gyro_C1  2.2nF/50V  [SMD_Capacitor_0603]
Gyro_C2  0.1uF/50V  [SMD_Capacitor_0603]
Gyro_C3  Package: 1206  [SMD_Capacitor_1206]  (hidden comment: 10u/25V)
Gyro_C4  Package: 1206  [SMD_Capacitor_1206]  (hidden comment: 10u/25V)
Gyro_C5  10nF/50V  [SMD_Capacitor_0603]
Gyro_FB1  120R/100MHz  [SMD_FerriteBead_1206]  (value not drawn)
Gyro_R1  Package: 1206  [SMD_Resistor_1206]  (hidden comment: 0.22R/1%)
Gyro_R2  10k  Package: 0603  [SMD_Resistor_0603]
Gyro_U1  ITG3200  [QFN24_4x4]  (parts A,B of 2)

### Ports
I2C (harness I2C)

### Harnesses
I2C: SDA, SCL

### Nets
DGND: Gyro_C1.2 Gyro_C2.2 Gyro_C3.2 Gyro_C4.2 Gyro_C5.2 Gyro_R2.2 Gyro_U1.1(CLKIN) Gyro_U1.11(RESV-G) Gyro_U1.18(GND)
OBC_3V3: Gyro_C5.1 Gyro_FB1.1 Gyro_U1.8(VLOGIC)
NetGyro_C1_1: Gyro_C1.1 Gyro_U1.20(CPOUT)
NetGyro_C2_1: Gyro_C2.1 Gyro_U1.10(REGOUT)
NetGyro_C3_1: Gyro_C3.1 Gyro_FB1.2 Gyro_R1.2 Gyro_U1.13(VDD)
NetGyro_C4_1: Gyro_C4.1 Gyro_R1.1
NetGyro_R2_1: Gyro_R2.1 Gyro_U1.9(AD0)
NetGyro_U1_23: Gyro_U1.23(SCL) ; port I2C.SCL
NetGyro_U1_24: Gyro_U1.24(SDA) ; port I2C.SDA

Not connected (* = marked no-connect by the designer): Gyro_U1 2(NC)* 3(NC)* 4(NC)* 5(NC)* 6(RESV)* 7(RESV)* 12(INT)* 14(NC)* 15(NC)* 16(NC)* 17(NC)* 19(RESV)* 21(RESV)* 22(RESV)*

### Notes on the sheet
- Title:
- Project:
- Author:
- Model:
- Document Number:
- Checked by:
- Rev:
- Date:
- Approved by:
- Sheet:
- of
- File name:

### Library data of the parts
Gyro_C1 Gyro_C2 Gyro_C5 = Cer_C0603T104K5RALTU: Ceramic Cap Kemet COTS 100n/50V X7R 0603; Manufacturer: Kemet; ManufacturerPartNumber: C0603T104K5RALTU; Package: 0603
  Gyro_C1: Value: 2.2nF/50V
  Gyro_C2: Value: 0.1uF/50V
  Gyro_C5: Value: 10nF/50V
Gyro_C3 Gyro_C4 = Cer_C1206T105K3RALTU: Ceramic Cap Kemet COTS 1u/25V X7R 1206; ManufacturerPartNumber: C1206T105K3RALTU; Manufacturer: Kemet; Value: 10u/25V
Gyro_FB1 = BLM31PG121SH1L: Ferrite bead, 1206, 0.02HM, 3.5A.; Manufacturer: Murata; Current Rating: 3.5A; Series Resistance DC: 0.02R; Package: 1206; Value: 120R/100MHz; ManufacturerPartNumber: BLM31PG121SH1L
Gyro_R1 = ERJ-8BQFR22V: Panasonic Resistor 0.22R 1% 1206 330mW; Manufacturer: Panasonic; ManufacturerPartNumber: ERJ-8BQFR22V; Value: 0.22R/1%
Gyro_R2 = Res: Value: Res

## Sheet PLD_Local-Supply.SchDoc: Local Supply
size A4; ApprovedBy: Piotr Kuligowski; CheckedBy: Piotr Kuligowski; Author: Michał Gumiela; DocumentNumber: PWSat2-xxx-DW-xxx; Revision: 1; SheetNumber: 5; SheetTotal: 13; Model: DM1
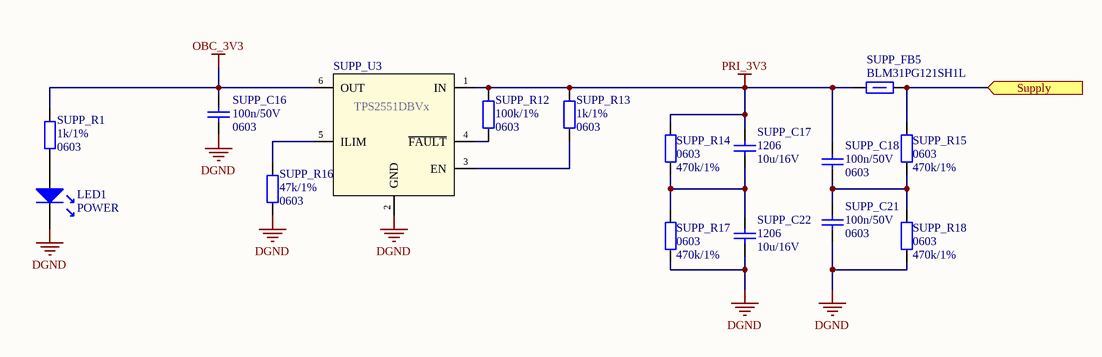
[diagram p6: PLD_Local-Supply.SchDoc]

### Parts
LED1  POWER  [SMD_LED_1206]
SUPP_C16  Package: 0603  [SMD_Capacitor_0603]  (hidden comment: 100n/50V)
SUPP_C17  Packge: 1206  [SMD_Capacitor_1206]  (hidden comment: 10u/16V)
SUPP_C18  Package: 0603  [SMD_Capacitor_0603]  (hidden comment: 100n/50V)
SUPP_C21  Package: 0603  [SMD_Capacitor_0603]  (hidden comment: 100n/50V)
SUPP_C22  Packge: 1206  [SMD_Capacitor_1206]  (hidden comment: 10u/16V)
SUPP_FB5  120R/100MHz  [SMD_FerriteBead_1206]  (value not drawn)
SUPP_R1  Package: 0603  [SMD_Resistor_0603]  (hidden comment: 1k/1%)
SUPP_R12  Package: 0603  [SMD_Resistor_0603]  (hidden comment: 100k/1%)
SUPP_R13  Package: 0603  [SMD_Resistor_0603]  (hidden comment: 1k/1%)
SUPP_R14  Package: 0603  [SMD_Resistor_0603]  (hidden comment: 470k/1%)
SUPP_R15  Package: 0603  [SMD_Resistor_0603]  (hidden comment: 470k/1%)
SUPP_R16  Package: 0603  [SMD_Resistor_0603]  (hidden comment: 47k/1%)
SUPP_R17  Package: 0603  [SMD_Resistor_0603]  (hidden comment: 470k/1%)
SUPP_R18  Package: 0603  [SMD_Resistor_0603]  (hidden comment: 470k/1%)
SUPP_U3  TPS2551DBVx  [SOT23-6]

### Ports
Supply (in)

### Nets
DGND: LED1.K SUPP_C16.1 SUPP_C21.2 SUPP_C22.2 SUPP_R16.2 SUPP_R17.2 SUPP_R18.2 SUPP_U3.2(GND)
OBC_3V3: SUPP_C16.2 SUPP_R1.1 SUPP_U3.6(OUT)
PRI_3V3: SUPP_C17.1 SUPP_C18.1 SUPP_FB5.2 SUPP_R12.1 SUPP_R13.1 SUPP_R14.1 SUPP_U3.1(IN)
PC-104_Supply_OBC+3V3: SUPP_FB5.1 SUPP_R15.1 ; port Supply
NetLED1_A: LED1.A SUPP_R1.2
NetSUPP_C17_2: SUPP_C17.2 SUPP_C22.1 SUPP_R14.2 SUPP_R17.1
NetSUPP_C18_2: SUPP_C18.2 SUPP_C21.1 SUPP_R15.2 SUPP_R18.1
NetSUPP_R12_2: SUPP_R12.2 SUPP_U3.4(~{FAULT})
NetSUPP_R13_2: SUPP_R13.2 SUPP_U3.3(EN)
NetSUPP_R16_1: SUPP_R16.1 SUPP_U3.5(ILIM)

### Notes on the sheet
- Title:
- Project:
- Author:
- Model:
- Document Number:
- Checked by:
- Rev:
- Date:
- Approved by:
- Sheet:
- of
- File name:

### Library data of the parts
LED1 = LED-1206_RED: LED diode, SMD1206 package.; Value: POWER; Supplier 1: Farnell; Farnell: 1581229
SUPP_C16 SUPP_C18 SUPP_C21 = Cer_C0603T104K5RALTU: Ceramic Cap Kemet COTS 100n/50V X7R 0603; Manufacturer: Kemet; ManufacturerPartNumber: C0603T104K5RALTU; Value: 100n/50V
SUPP_C17 SUPP_C22 = Cer_C1206T106K4RACTU: Ceramic Cap Kemet COTS 10u/16V X7R 1206; ManufacturerPartNumber: C1206T106K4RACTU; Manufacturer: Kemet; Value: 10u/16V
SUPP_FB5 = BLM31PG121SH1L: as Gyro_FB1 on sheet PLD_Gyroscopes; Package: 1206; Value: 120R/100MHz; ManufacturerPartNumber: BLM31PG121SH1L
SUPP_R1 SUPP_R13 = CRCW06031K00FKxxxx: as R6 on sheet PLD_Top; Manufacturer: Vishay; ManufacturerPartNumber: CRCW06031K00FKxxxx; Value: 1k/1%
SUPP_R12 = CRCW0603100KFKxxxx: 100k/1% Vishay CRCW 0603 Resistor. 100mW, 100ppm, 75V.; Manufacturer: Vishay; ManufacturerPartNumber: CRCW0603100KFKxxxx; Value: 100k/1%
SUPP_R14 SUPP_R15 SUPP_R17 SUPP_R18 = CRCW0603470KFKxxxx: 470k/1% Vishay CRCW 0603 Resistor. 100mW, 100ppm, 75V.; Manufacturer: Vishay; ManufacturerPartNumber: CRCW0603470KFKxxxx; Value: 470k/1%
SUPP_R16 = CRCW060347K0FKxxxx: 47k/1% Vishay CRCW 0603 Resistor. 100mW, 100ppm, 75V.; Manufacturer: Vishay; ManufacturerPartNumber: CRCW060347K0FKxxxx; Value: 47k/1%
SUPP_U3 = TPS2551DBVx: Adjustable Current-Limited Power-Distribution Switch.; Manufacturer: Texas Instruments; Value: TPS2551DBVx

## Sheet PLD_Flash-Memory.SchDoc: Flash Memory
size A4; ApprovedBy: Piotr Kuligowski; CheckedBy: Piotr Kuligowski; Author: Michał Gumiela; DocumentNumber: PWSat2-xxx-DW-xxx; Revision: 1; SheetNumber: 12; SheetTotal: 13; Model: DM1
Used 3 times, as channels PLD Top/Flash Memory 3, PLD Top/Flash Memory 2, PLD Top/Flash Memory 1. Parts and nets are listed once, with the designators drawn on the sheet.
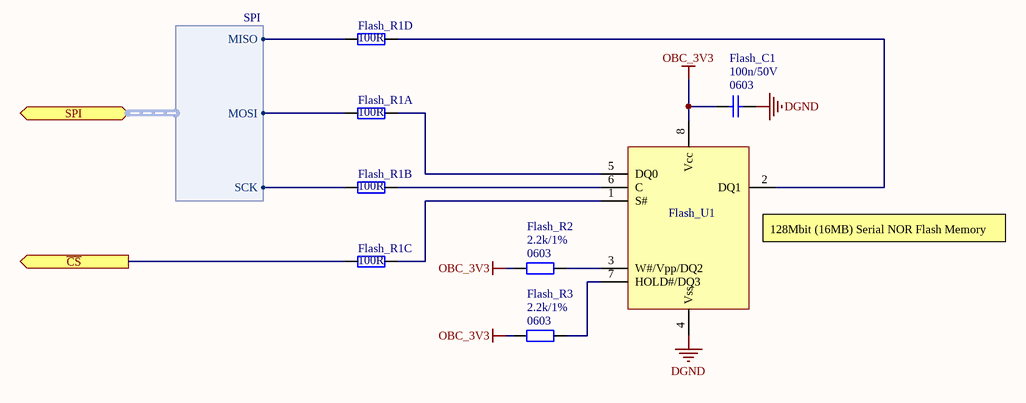
[diagram p7: PLD_Flash-Memory.SchDoc]

### Parts
Flash_C1  Package: 0603  [SMD_Capacitor_0603]  (hidden comment: 100n/50V)
Flash_R1  100R  [SMD_RESISTOR_ARRAY_YC124]  (parts A,B,C,D of 4)
Flash_R2  Package: 0603  [SMD_Resistor_0603]  (hidden comment: 2.2k/1%)
Flash_R3  Package: 0603  [SMD_Resistor_0603]  (hidden comment: 2.2k/1%)
Flash_U1  (no value)  [DIP8 ADAPTER]

### Ports
SPI (harness SPI), ~{CS} (out)

### Harnesses
SPI: MISO, MOSI, SCK

### Nets
DGND: Flash_C1.1 Flash_U1.4(Vss)
OBC_3V3: Flash_C1.2 Flash_R2.2 Flash_R3.2 Flash_U1.8(Vcc)
~{CS}: Flash_R1.6 ; port ~{CS}
NetFlash_R1_1: Flash_R1.1 Flash_U1.5(DQ0)
NetFlash_R1_2: Flash_R1.2 Flash_U1.6(C)
NetFlash_R1_3: Flash_R1.3 Flash_U1.1(S#)
NetFlash_R1_4: Flash_R1.4 Flash_U1.2(DQ1)
NetFlash_R1_5: Flash_R1.5 ; port SPI.MISO
NetFlash_R1_7: Flash_R1.7 ; port SPI.SCK
NetFlash_R1_8: Flash_R1.8 ; port SPI.MOSI
NetFlash_R2_1: Flash_R2.1 Flash_U1.3(W#/Vpp/DQ2)
NetFlash_R3_1: Flash_R3.1 Flash_U1.7(HOLD#/DQ3)

### Channels
PLD Top/Flash Memory 3: designators end in _Flash_Memory_3; ports ~{CS}=Piggyback_GPIO_PA10
PLD Top/Flash Memory 2: designators end in _Flash_Memory_2; ports ~{CS}=Piggyback_GPIO_PA9
PLD Top/Flash Memory 1: designators end in _Flash_Memory_1; ports ~{CS}=Piggyback_GPIO_PA8

### Notes on the sheet
- (near Flash_U1) 128Mbit (16MB) Serial NOR Flash Memory
- Title:
- Project:
- Author:
- Model:
- Document Number:
- Checked by:
- Rev:
- Date:
- Approved by:
- Sheet:
- of
- File name:

### Library data of the parts
Flash_C1 = Cer_C0603T104K5RALTU: Ceramic Cap Kemet COTS 100n/50V X7R 0603; Manufacturer: Kemet; ManufacturerPartNumber: C0603T104K5RALTU; Value: 100n/50V
Flash_R1 = 4ResPack: RESISTOR ARRAY, 4 x 0402; URL: http://pl.farnell.com/yageo-phycomp/yc124-jr-072k2l/resistor-array-arv341-4-x-0402/dp/9235388; value: 100R
Flash_R2 Flash_R3 = CRCW06032K20FKxxxx: 2.2k/1% Vishay CRCW 0603 Resistor. 100mW, 100ppm, 75V.; ManufacturerPartNumber: CRCW06032K20FKxxxx; Manufacturer: Vishay; Value: 2.2k/1%
Flash_U1 = N25Q128A13ESE40G: 128Mbit, 3V Serial NOR Flash Memory; Manufacturer: Micron; ManufacturerPartNumber: N25Q128A13ESE40G

## Sheet PLD_I2C-Repeater.SchDoc: I2C Repeater for RadFET
size A4; ApprovedBy: Piotr Kuligowski; CheckedBy: Piotr Kuligowski; Author: Michał Gumiela; DocumentNumber: PWSat2-xxx-DW-xxx; Revision: 1; SheetNumber: 8; SheetTotal: 13; Model: DM1
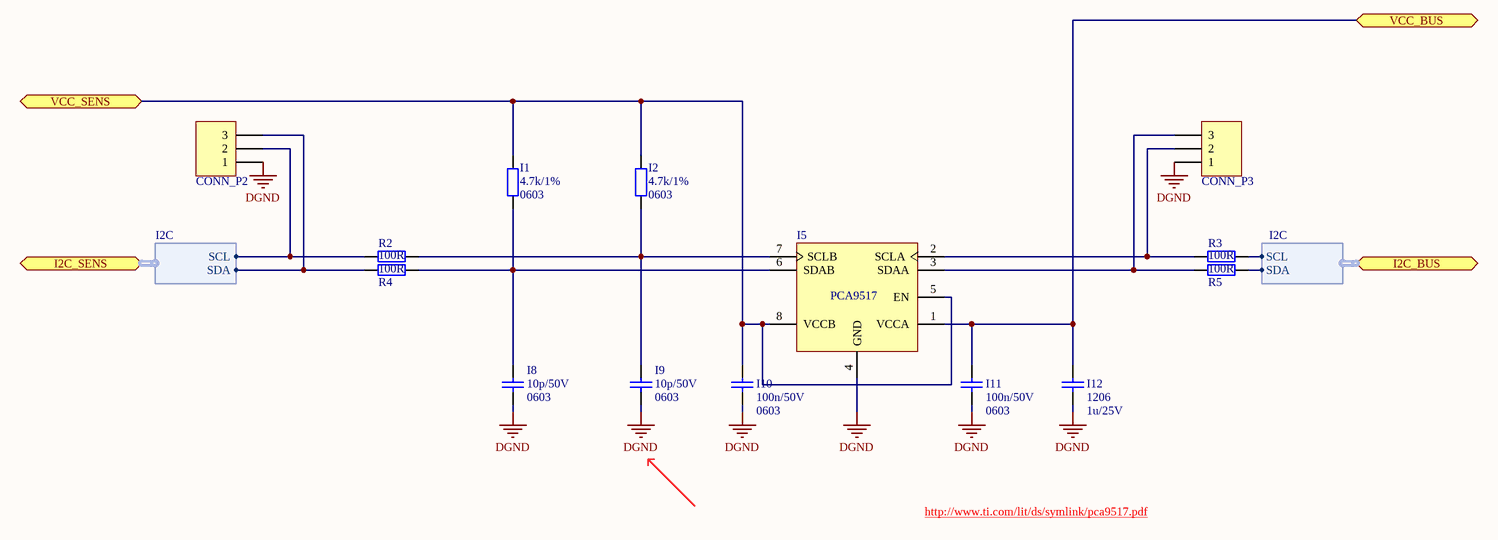
[diagram p8: PLD_I2C-Repeater.SchDoc]

### Parts
CONN_P2  Header 3  [HEADER 1X3 MALE]  (value not drawn)
CONN_P3  Header 3  [HEADER 1X3 MALE]  (value not drawn)
I1  Package: 0603  [SMD_Resistor_0603]  (hidden comment: 4.7k/1%)
I2  Package: 0603  [SMD_Resistor_0603]  (hidden comment: 4.7k/1%)
I5  PCA9517  [TSSOP8_L]
I8  Package: 0603  [SMD_Capacitor_0603]  (hidden comment: 10p/50V)
I9  Package: 0603  [SMD_Capacitor_0603]  (hidden comment: 10p/50V)
I10  Package: 0603  [SMD_Capacitor_0603]  (hidden comment: 100n/50V)
I11  Package: 0603  [SMD_Capacitor_0603]  (hidden comment: 100n/50V)
I12  Package: 1206  [SMD_Capacitor_1206]  (hidden comment: 1u/25V)
R2  100R  [SMD_Resistor_0603]
R3  100R  [SMD_Resistor_0603]
R4  100R  [SMD_Resistor_0603]
R5  100R  [SMD_Resistor_0603]

### Ports
I2C_BUS (harness I2C), I2C_SENS (harness I2C), VCC_BUS, VCC_SENS

### Harnesses
I2C: SDA, SCL

### Nets
DGND: CONN_P2.1 CONN_P3.1 I5.4(GND) I8.2 I9.2 I10.1 I11.1 I12.1
OBC_3V3: I1.1 I2.1 I5.1(VCCA) I5.5(EN) I5.8(VCCB) I10.2 I11.2 I12.2 ; port VCC_BUS, port VCC_SENS
PC-104_I2C-Payload_SCL: R3.2 ; port I2C_BUS.SCL
PC-104_I2C-Payload_SDA: R5.2 ; port I2C_BUS.SDA
NetCONN_P2_2: CONN_P2.2 R2.1 ; port I2C_SENS.SCL
NetCONN_P2_3: CONN_P2.3 R4.1 ; port I2C_SENS.SDA
NetCONN_P3_2: CONN_P3.2 I5.2(SCLA) R3.1
NetCONN_P3_3: CONN_P3.3 I5.3(SDAA) R5.1
NetI1_2: I1.2 I5.6(SDAB) I8.1 R4.2
NetI2_2: I2.2 I5.7(SCLB) I9.1 R2.2

### Notes on the sheet
- http://www.ti.com/lit/ds/symlink/pca9517.pdf
- Title:
- Project:
- Author:
- Model:
- Document Number:
- Checked by:
- Rev:
- Date:
- Approved by:
- Sheet:
- of
- File name:

### Library data of the parts
CONN_P2 CONN_P3 = Header 3: Header, 3-Pin; LatestRevisionDate: 17-Jul-2002; LatestRevisionNote: Re-released for DXP Platform.; Publisher: Altium Limited
I1 I2 = CRCW06034K70FKxxxx: 4.7k/1% Vishay CRCW 0603 Resistor. 100mW, 100ppm, 75V.; Manufacturer: Vishay; ManufactuerPartNumber: CRCW06034K70FKxxxx; Value: 4.7k/1%
I5 = PCA9517: Level-Translating I2C Bus Repeater; Manufacturer: Texas Instruments; ManufacturerPartNumber: PCA9517
I8 I9 = Cer_GCM1885C1H100JA16D: Ceramic Cap Murata Automotive 10p/50V C0G 0603; Manufacturer: Murata; ManufacturerPartNumber: GCM1885C1H100JA16D; Value: 10p/50V
I10 I11 = Cer_C0603T104K5RALTU: Ceramic Cap Kemet COTS 100n/50V X7R 0603; Manufacturer: Kemet; ManufacturerPartNumber: C0603T104K5RALTU; Value: 100n/50V
I12 = Cer_C1206T105K3RALTU: Ceramic Cap Kemet COTS 1u/25V X7R 1206; ManufacturerPartNumber: C1206T105K3RALTU; Manufacturer: Kemet; Value: 1u/25V
R2-R5 = Res: Value: 100R; Package: 0603

## Sheet PLD_FRAM-Memory.SchDoc: Flash Memory
size A4; ApprovedBy: Piotr Kuligowski; CheckedBy: Piotr Kuligowski; Author: Michał Gumiela; DocumentNumber: PWSat2-xxx-DW-xxx; Revision: 1; SheetNumber: 13; SheetTotal: 13; Model: DM1
Used 3 times, as channels PLD Top/FRAM Memory 1, PLD Top/FRAM Memory 2, PLD Top/FRAM Memory 3. Parts and nets are listed once, with the designators drawn on the sheet.
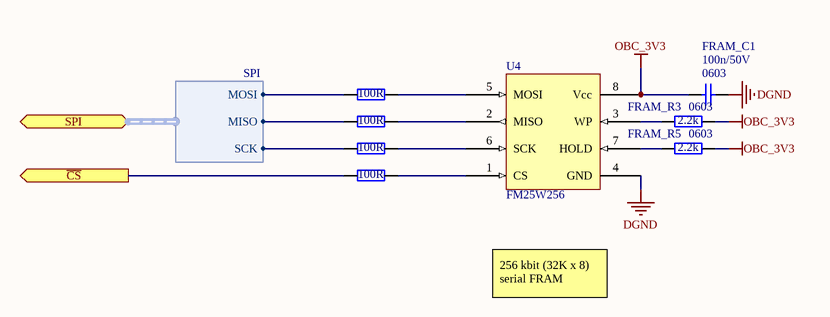
[diagram p9: PLD_FRAM-Memory.SchDoc]

### Parts
FRAM_C1  Package: 0603  [SMD_Capacitor_0603]  (hidden comment: 100n/50V)
FRAM_R1  100R  [SMD_RESISTOR_ARRAY_YC124]  (parts A,B,C,D of 4)
FRAM_R3  Package: 0603  [SMD_Resistor_0603]  (hidden comment: 2.2k)
FRAM_R5  Package: 0603  [SMD_Resistor_0603]  (hidden comment: 2.2k)
U4  FM25W256  [DIP8 ADAPTER]

### Ports
SPI (harness SPI), ~{CS} (out)

### Harnesses
SPI: MISO, MOSI, SCK

### Nets
DGND: FRAM_C1.1 U4.4(GND)
OBC_3V3: FRAM_C1.2 FRAM_R3.2 FRAM_R5.2 U4.8(Vcc)
~{CS}: FRAM_R1.6 ; port ~{CS}
NetFRAM_R1_1: FRAM_R1.1 U4.5(MOSI)
NetFRAM_R1_2: FRAM_R1.2 U4.6(SCK)
NetFRAM_R1_3: FRAM_R1.3 U4.1(CS)
NetFRAM_R1_4: FRAM_R1.4 U4.2(MISO)
NetFRAM_R1_5: FRAM_R1.5 ; port SPI.MISO
NetFRAM_R1_7: FRAM_R1.7 ; port SPI.SCK
NetFRAM_R1_8: FRAM_R1.8 ; port SPI.MOSI
NetFRAM_R3_1: FRAM_R3.1 U4.3(WP)
NetFRAM_R5_1: FRAM_R5.1 U4.7(HOLD)

### Channels
PLD Top/FRAM Memory 1: designators end in _FRAM_Memory_1; ports ~{CS}=Piggyback_GPIO_PA11
PLD Top/FRAM Memory 2: designators end in _FRAM_Memory_2; ports ~{CS}=Piggyback_GPIO_PA12
PLD Top/FRAM Memory 3: designators end in _FRAM_Memory_3; ports ~{CS}=Piggyback_GPIO_PA13

### Notes on the sheet
- 256 kbit (32K x 8) serial FRAM
- Title:
- Project:
- Author:
- Model:
- Document Number:
- Checked by:
- Rev:
- Date:
- Approved by:
- Sheet:
- of
- File name:

### Library data of the parts
FRAM_C1 = Cer_C0603T104K5RALTU: Ceramic Cap Kemet COTS 100n/50V X7R 0603; Manufacturer: Kemet; ManufacturerPartNumber: C0603T104K5RALTU; Value: 100n/50V
FRAM_R1 = 4ResPack: RESISTOR ARRAY, 4 x 0402; URL: http://pl.farnell.com/yageo-phycomp/yc124-jr-072k2l/resistor-array-arv341-4-x-0402/dp/9235388; value: 100R
FRAM_R3 FRAM_R5 = CRCW06032K20FKxxxx: as Flash_R2 on sheet PLD_Flash-Memory; ManufacturerPartNumber: CRCW06032K20FKxxxx; Manufacturer: Vishay; Value: 2.2k
U4 = FM25W256: 256Kb (8k x 32) SPI F-RAM

## Sheet PLD_I2C_Switch.SchDoc: I2C Switch
size A4; ApprovedBy: Piotr Kuligowski; CheckedBy: Piotr Kuligowski; Author: Michał Gumiela; DocumentNumber: PWSat2-xxx-DW-xxx; Revision: 1; SheetNumber: 7; SheetTotal: 13; Model: DM1
Used 3 times, as channels PLD Top/I2C_SW_Gyro, PLD Top/I2C_SW_RTC, PLD Top/I2C_SW_AVR. Parts and nets are listed once, with the designators drawn on the sheet.
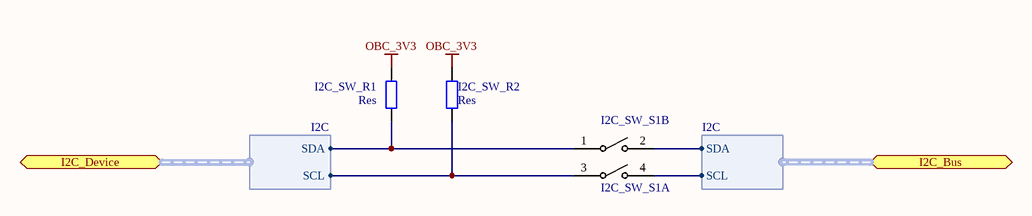
[diagram p10: PLD_I2C_Switch.SchDoc]

### Parts
I2C_SW_R1  Res  [SMD_Resistor_0603]
I2C_SW_R2  Res  [SMD_Resistor_0603]
I2C_SW_S1  MCEPM-02  [MCEPM-02]  (value not drawn)  (parts A,B of 2)

### Ports
I2C_Bus (harness I2C), I2C_Device (harness I2C)

### Harnesses
I2C: SDA, SCL

### Nets
OBC_3V3: I2C_SW_R1.1 I2C_SW_R2.1
NetI2C_SW_R1_2: I2C_SW_R1.2 I2C_SW_S1.1 ; port I2C_Device.SDA
NetI2C_SW_R2_2: I2C_SW_R2.2 I2C_SW_S1.3 ; port I2C_Device.SCL
NetI2C_SW_S1_2: I2C_SW_S1.2 ; port I2C_Bus.SDA
NetI2C_SW_S1_4: I2C_SW_S1.4 ; port I2C_Bus.SCL

### Channels
PLD Top/I2C_SW_Gyro: designators end in _I2C_SW_Gyro
PLD Top/I2C_SW_RTC: designators end in _I2C_SW_RTC
PLD Top/I2C_SW_AVR: designators end in _I2C_SW_AVR

### Notes on the sheet
- Title:
- Project:
- Author:
- Model:
- Document Number:
- Checked by:
- Rev:
- Date:
- Approved by:
- Sheet:
- of
- File name:

### Library data of the parts
I2C_SW_R1 I2C_SW_R2 = Res: Value: Res; Package: 0603
I2C_SW_S1 = MCEPM-02: Supplier 1: Farnell

## Sheet PLD_Connectors_PC-104.SchDoc: Connectors - PC-104
size A4; ApprovedBy: Piotr Kuligowski; CheckedBy: Piotr Kuligowski; Author: Michał Gumiela; DocumentNumber: PWSat2-xxx-DW-xxx; Revision: 1; SheetNumber: 2; SheetTotal: 13; Model: DM1
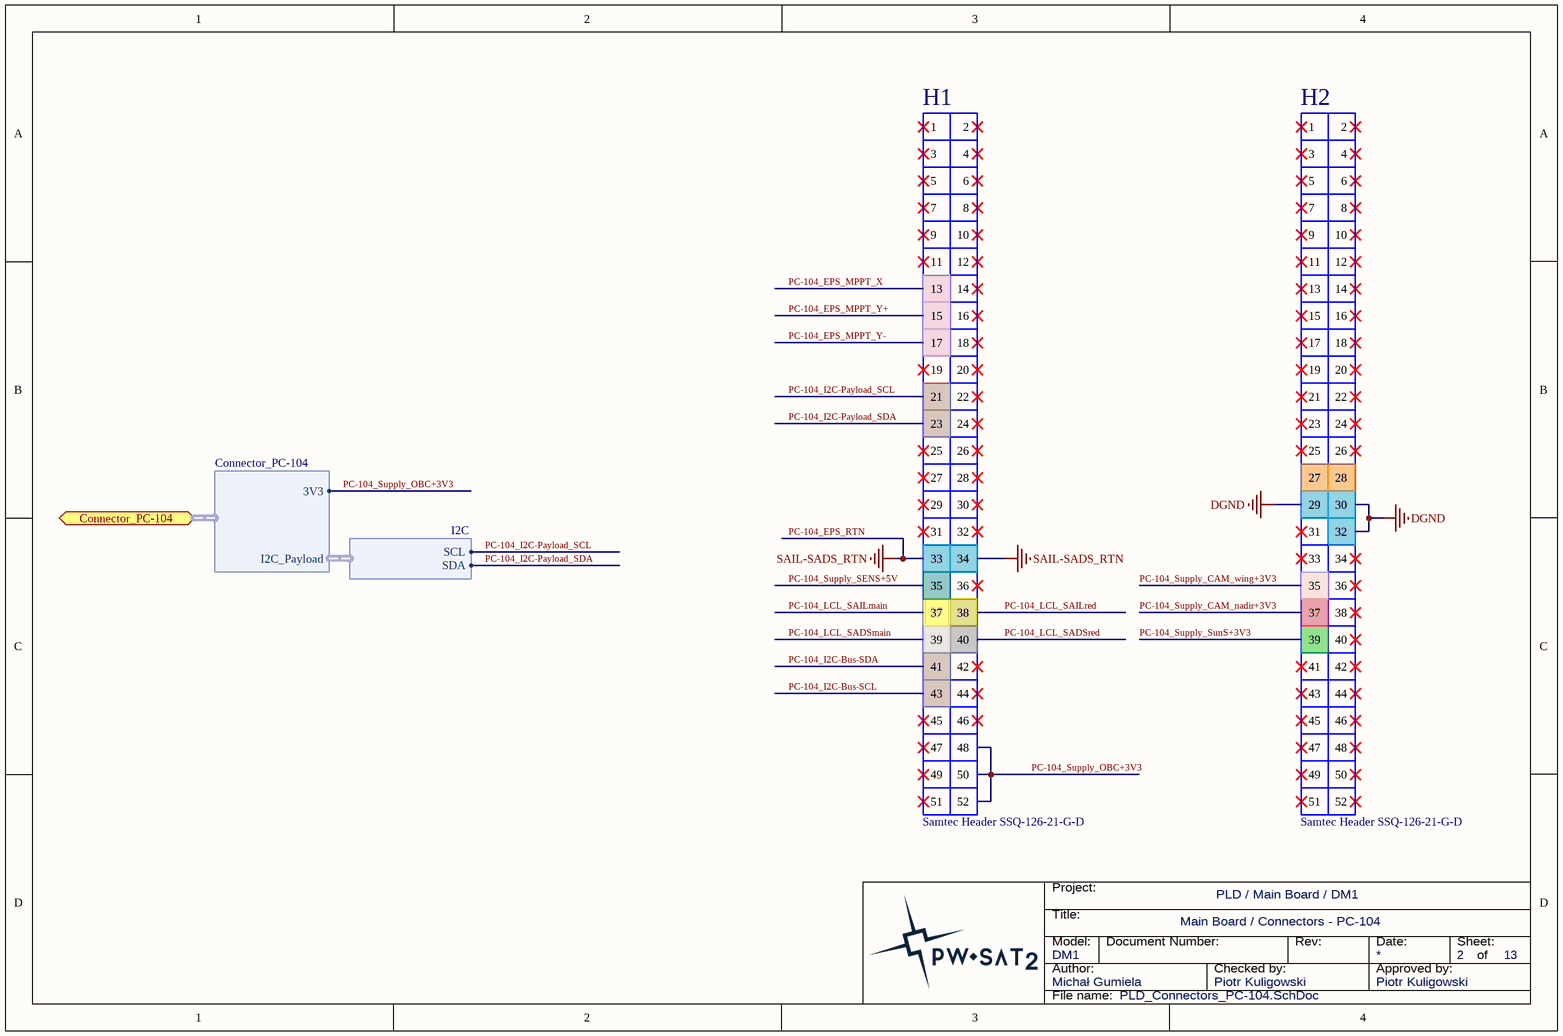
[diagram p11: PLD_Connectors_PC-104.SchDoc]

### Parts
H1  Samtec Header SSQ-126-21-G-D  [Samtec_SSQ-126-21-G-D]
H2  Samtec Header SSQ-126-21-G-D  [Samtec_SSQ-126-21-G-D]

### Ports
Connector_PC-104 (harness Connector_PC-104)

### Harnesses
I2C: SDA, SCL
Connector_PC-104: I2C_Payload, 3V3

### Nets
DGND: H2.29 H2.30 H2.32
PC-104_EPS_RTN: H1.33 H1.34  [also labelled SAIL-SADS_RTN]
PC-104_EPS_MPPT_X: H1.13
PC-104_EPS_MPPT_Y+: H1.15
PC-104_EPS_MPPT_Y-: H1.17
PC-104_I2C-Bus-SCL: H1.43
PC-104_I2C-Bus-SDA: H1.41
PC-104_I2C-Payload_SCL: H1.21 ; harness I2C.SCL
PC-104_I2C-Payload_SDA: H1.23 ; harness I2C.SDA
PC-104_LCL_SADSmain: H1.39
PC-104_LCL_SADSred: H1.40
PC-104_LCL_SAILmain: H1.37
PC-104_LCL_SAILred: H1.38
PC-104_Supply_CAM_nadir+3V3: H2.37
PC-104_Supply_CAM_wing+3V3: H2.35
PC-104_Supply_OBC+3V3: H1.48 H1.50 H1.52 ; port Connector_PC-104.3V3
PC-104_Supply_SENS+5V: H1.35
PC-104_Supply_SunS+3V3: H2.39

Not connected (* = marked no-connect by the designer): H1 1* 2* 3* 4* 5* 6* 7* 8* 9* 10* 11* 12* 14* 16* 18* 19* 20* 22* 24* 25* 26* 27* 28* 29* 30* 31* 32* 36* 42* 44* 45* 46* 47* 49* 51*; H2 1* 2* 3* 4* 5* 6* 7* 8* 9* 10* 11* 12* 13* 14* 15* 16* 17* 18* 19* 20* 21* 22* 23* 24* 25* 26* 27 28 31* 33* 34* 36* 38* 40* 41* 42* 43* 44* 45* 46* 47* 48* 49* 50* 51* 52*

### Notes on the sheet
- Title:
- Project:
- Author:
- Model:
- Document Number:
- Checked by:
- Rev:
- Date:
- Approved by:
- Sheet:
- of
- File name:

### Library data of the parts
H1 H2 = Samtec_SSQ-126-xx-x-D: Samtec SSQ Series Header , 2.54mm pitch, 2x26pin. PC-104 Stack Connector.; HelpUrl: http://suddendocs.samtec.com/catalog_english/ssq_th.pdf; Value: Samtec Header SSQ-126-21-G-D

## Sheet PLD_Connectors_Piggyback.SchDoc: Connectors - Piggyback
size A4; ApprovedBy: Piotr Kuligowski; CheckedBy: Piotr Kuligowski; Author: Michał Gumiela; DocumentNumber: PWSat2-xxx-DW-xxx; Revision: 1; SheetNumber: 3; SheetTotal: 13; Model: DM1
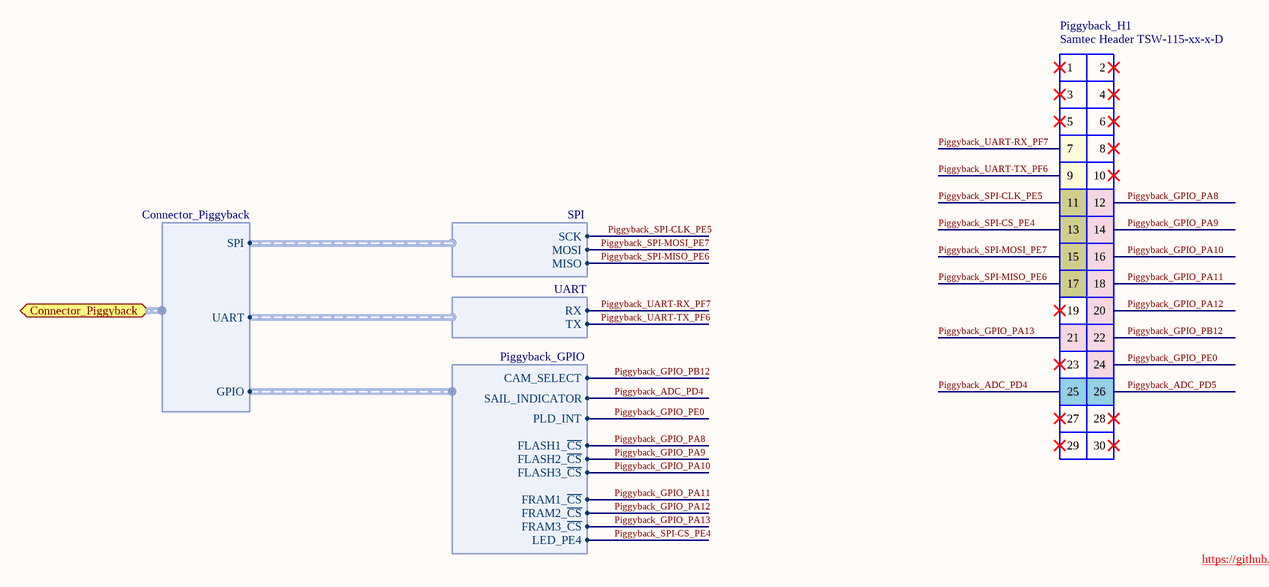
[diagram p12: PLD_Connectors_Piggyback.SchDoc]

### Parts
Piggyback_H1  Samtec Header TSW-115-xx-x-D  [Samtec_TSW-115-07-L-D]

### Ports
Connector_Piggyback (harness Connector_Piggyback)

### Harnesses
SPI: MISO, MOSI, SCK
UART: RX, TX
Connector_Piggyback: SPI, UART, GPIO
Piggyback_GPIO: CAM_SELECT, FLASH1_~{CS}, FRAM1_~{CS}, PLD_INT, FLASH2_~{CS}, FLASH3_~{CS}, FRAM2_~{CS}, FRAM3_~{CS}, SAIL_INDICATOR, LED_PE4

### Nets
Piggyback_ADC_PD4: Piggyback_H1.25 ; harness Piggyback_GPIO.SAIL_INDICATOR
Piggyback_ADC_PD5: Piggyback_H1.26
Piggyback_GPIO_PA8: Piggyback_H1.12 ; harness Piggyback_GPIO.FLASH1_~{CS}
Piggyback_GPIO_PA9: Piggyback_H1.14 ; harness Piggyback_GPIO.FLASH2_~{CS}
Piggyback_GPIO_PA10: Piggyback_H1.16 ; harness Piggyback_GPIO.FLASH3_~{CS}
Piggyback_GPIO_PA11: Piggyback_H1.18 ; harness Piggyback_GPIO.FRAM1_~{CS}
Piggyback_GPIO_PA12: Piggyback_H1.20 ; harness Piggyback_GPIO.FRAM2_~{CS}
Piggyback_GPIO_PA13: Piggyback_H1.21 ; harness Piggyback_GPIO.FRAM3_~{CS}
Piggyback_GPIO_PB12: Piggyback_H1.22 ; harness Piggyback_GPIO.CAM_SELECT
Piggyback_GPIO_PE0: Piggyback_H1.24 ; harness Piggyback_GPIO.PLD_INT  [project net INT]
Piggyback_SPI-CLK_PE5: Piggyback_H1.11 ; harness SPI.SCK
Piggyback_SPI-CS_PE4: Piggyback_H1.13 ; harness Piggyback_GPIO.LED_PE4
Piggyback_SPI-MISO_PE6: Piggyback_H1.17 ; harness SPI.MISO
Piggyback_SPI-MOSI_PE7: Piggyback_H1.15 ; harness SPI.MOSI
Piggyback_UART-RX_PF7: Piggyback_H1.7 ; harness UART.RX
Piggyback_UART-TX_PF6: Piggyback_H1.9 ; harness UART.TX

Not connected (* = marked no-connect by the designer): Piggyback_H1 1* 2* 3* 4* 5* 6* 8* 10* 19* 23* 27* 28* 29* 30*

### Notes on the sheet
- https://github.com/PW-Sat2/Documentation/raw/master/obc/obc_datasheet_esl_cubecomputer.pdf
- Title:
- Project:
- Author:
- Model:
- Document Number:
- Checked by:
- Rev:
- Date:
- Approved by:
- Sheet:
- of
- File name:

### Library data of the parts
Piggyback_H1 = Samtec_TSW-115-xx-x-D: Samtec TSW Series Header , 2.54mm pitch, 2x15pin. PC-104 Stack Connector.; HelpUrl: http://suddendocs.samtec.com/catalog_english/htsw_th.pdf; Value: Samtec Header TSW-115-xx-x-D

## Nets that join several sheets
CAM_nadir_3V3: PLD_Connectors (CONN_H5.4), PLD_CAM_MUX (6 pins)
CAM_wing_3V3: PLD_Connectors (CONN_H3.4), PLD_CAM_MUX (6 pins)
DGND: PLD_Connectors (17 pins), PLD_Top (LED8.K), PLD_RTC (5 pins), AVR (16 pins), PLD_CAM_MUX (12 pins), PLD_Gyroscopes (9 pins), PLD_Local-Supply (8 pins), PLD Top/Flash Memory 3 (Flash_C1_Flash_Memory_3.1 Flash_U1_Flash_Memory_3.4), PLD_I2C-Repeater (8 pins), PLD Top/FRAM Memory 1 (FRAM_C1_FRAM_Memory_1.1 U4_FRAM_Memory_1.4), PLD Top/Flash Memory 2 (Flash_C1_Flash_Memory_2.1 Flash_U1_Flash_Memory_2.4), PLD Top/Flash Memory 1 (Flash_C1_Flash_Memory_1.1 Flash_U1_Flash_Memory_1.4), PLD Top/FRAM Memory 2 (FRAM_C1_FRAM_Memory_2.1 U4_FRAM_Memory_2.4), PLD Top/FRAM Memory 3 (FRAM_C1_FRAM_Memory_3.1 U4_FRAM_Memory_3.4), PLD_Connectors_PC-104 (H2.29 H2.30 H2.32)
OBC_3V3: PLD_Connectors (P2.2 P2.4 P2.6 P2.8), PLD_RTC (RTC_D1.A), AVR (12 pins), PLD_CAM_MUX (10 pins), PLD_Gyroscopes (Gyro_C5.1 Gyro_FB1.1 Gyro_U1.8), PLD_Local-Supply (SUPP_C16.2 SUPP_R1.1 SUPP_U3.6), PLD Top/Flash Memory 3 (Flash_C1_Flash_Memory_3.2 Flash_R2_Flash_Memory_3.2 Flash_R3_Flash_Memory_3.2 Flash_U1_Flash_Memory_3.8), PLD_I2C-Repeater (8 pins), PLD Top/FRAM Memory 1 (FRAM_C1_FRAM_Memory_1.2 FRAM_R3_FRAM_Memory_1.2 FRAM_R5_FRAM_Memory_1.2 U4_FRAM_Memory_1.8), PLD Top/Flash Memory 2 (Flash_C1_Flash_Memory_2.2 Flash_R2_Flash_Memory_2.2 Flash_R3_Flash_Memory_2.2 Flash_U1_Flash_Memory_2.8), PLD Top/Flash Memory 1 (Flash_C1_Flash_Memory_1.2 Flash_R2_Flash_Memory_1.2 Flash_R3_Flash_Memory_1.2 Flash_U1_Flash_Memory_1.8), PLD Top/FRAM Memory 2 (FRAM_C1_FRAM_Memory_2.2 FRAM_R3_FRAM_Memory_2.2 FRAM_R5_FRAM_Memory_2.2 U4_FRAM_Memory_2.8), PLD Top/FRAM Memory 3 (FRAM_C1_FRAM_Memory_3.2 FRAM_R3_FRAM_Memory_3.2 FRAM_R5_FRAM_Memory_3.2 U4_FRAM_Memory_3.8), PLD Top/I2C_SW_Gyro (I2C_SW_R1_I2C_SW_Gyro.1 I2C_SW_R2_I2C_SW_Gyro.1), PLD Top/I2C_SW_RTC (I2C_SW_R1_I2C_SW_RTC.1 I2C_SW_R2_I2C_SW_RTC.1), PLD Top/I2C_SW_AVR (I2C_SW_R1_I2C_SW_AVR.1 I2C_SW_R2_I2C_SW_AVR.1)
PRI_3V3: PLD_Connectors (P3.2 P3.4), PLD_Local-Supply (7 pins)
INT: AVR (AVR_U1.33), PLD_Connectors_Piggyback (Piggyback_H1.24)
NetCONN_H3_2: PLD_Connectors (CONN_H3.2), PLD_CAM_MUX (MUX_R2.1 MUX_R3.1)
NetCONN_H3_3: PLD_Connectors (CONN_H3.3), PLD_CAM_MUX (MUX_R1.1 MUX_R4.1)
NetCONN_H5_2: PLD_Connectors (CONN_H5.2), PLD_CAM_MUX (MUX_R8.1 MUX_R9.1)
NetCONN_H5_3: PLD_Connectors (CONN_H5.3), PLD_CAM_MUX (MUX_R5.1 MUX_R10.1)
NetCONN_P1_1: PLD_Connectors (CONN_P1.1), AVR (R10.1)
NetCONN_P1_2: PLD_Connectors (CONN_P1.2), AVR (R11.1)
NetCONN_P2_2: PLD_I2C-Repeater (CONN_P2.2 R2.1), PLD Top/I2C_SW_Gyro (I2C_SW_S1_I2C_SW_Gyro.4), PLD Top/I2C_SW_RTC (I2C_SW_S1_I2C_SW_RTC.4), PLD Top/I2C_SW_AVR (I2C_SW_S1_I2C_SW_AVR.4)
NetCONN_P2_3: PLD_I2C-Repeater (CONN_P2.3 R4.1), PLD Top/I2C_SW_Gyro (I2C_SW_S1_I2C_SW_Gyro.2), PLD Top/I2C_SW_RTC (I2C_SW_S1_I2C_SW_RTC.2), PLD Top/I2C_SW_AVR (I2C_SW_S1_I2C_SW_AVR.2)
NetGyro_U1_23: PLD_Gyroscopes (Gyro_U1.23), PLD Top/I2C_SW_Gyro (I2C_SW_R2_I2C_SW_Gyro.2 I2C_SW_S1_I2C_SW_Gyro.3)
NetGyro_U1_24: PLD_Gyroscopes (Gyro_U1.24), PLD Top/I2C_SW_Gyro (I2C_SW_R1_I2C_SW_Gyro.2 I2C_SW_S1_I2C_SW_Gyro.1)
NetI2C_SW_R1_I2C_SW_RTC_2: PLD_RTC (RTC_U1.5), PLD Top/I2C_SW_RTC (I2C_SW_R1_I2C_SW_RTC.2 I2C_SW_S1_I2C_SW_RTC.1)
NetI2C_SW_R2_I2C_SW_RTC_2: PLD_RTC (RTC_U1.6), PLD Top/I2C_SW_RTC (I2C_SW_R2_I2C_SW_RTC.2 I2C_SW_S1_I2C_SW_RTC.3)
PC-104_I2C-Payload_SCL: PLD_I2C-Repeater (R3.2), PLD_Connectors_PC-104 (H1.21)
PC-104_I2C-Payload_SDA: PLD_I2C-Repeater (R5.2), PLD_Connectors_PC-104 (H1.23)
PC-104_Supply_OBC+3V3: PLD_Local-Supply (SUPP_FB5.1 SUPP_R15.1), PLD_Connectors_PC-104 (H1.48 H1.50 H1.52)
Piggyback_ADC_PD4: AVR (AVR_U1.32), PLD_Connectors_Piggyback (Piggyback_H1.25)
Piggyback_GPIO_PA8: PLD Top/Flash Memory 1 (Flash_R1_Flash_Memory_1.6), PLD_Connectors_Piggyback (Piggyback_H1.12)
Piggyback_GPIO_PA9: PLD Top/Flash Memory 2 (Flash_R1_Flash_Memory_2.6), PLD_Connectors_Piggyback (Piggyback_H1.14)
Piggyback_GPIO_PA10: PLD Top/Flash Memory 3 (Flash_R1_Flash_Memory_3.6), PLD_Connectors_Piggyback (Piggyback_H1.16)
Piggyback_GPIO_PA11: PLD Top/FRAM Memory 1 (FRAM_R1_FRAM_Memory_1.6), PLD_Connectors_Piggyback (Piggyback_H1.18)
Piggyback_GPIO_PA12: PLD Top/FRAM Memory 2 (FRAM_R1_FRAM_Memory_2.6), PLD_Connectors_Piggyback (Piggyback_H1.20)
Piggyback_GPIO_PA13: PLD Top/FRAM Memory 3 (FRAM_R1_FRAM_Memory_3.6), PLD_Connectors_Piggyback (Piggyback_H1.21)
Piggyback_GPIO_PB12: PLD_CAM_MUX (MUX_R15.1 R9.2), PLD_Connectors_Piggyback (Piggyback_H1.22)
Piggyback_SPI-CLK_PE5: PLD Top/Flash Memory 3 (Flash_R1_Flash_Memory_3.7), PLD Top/FRAM Memory 1 (FRAM_R1_FRAM_Memory_1.7), PLD Top/Flash Memory 2 (Flash_R1_Flash_Memory_2.7), PLD Top/Flash Memory 1 (Flash_R1_Flash_Memory_1.7), PLD Top/FRAM Memory 2 (FRAM_R1_FRAM_Memory_2.7), PLD Top/FRAM Memory 3 (FRAM_R1_FRAM_Memory_3.7), PLD_Connectors_Piggyback (Piggyback_H1.11)
Piggyback_SPI-CS_PE4: PLD_Top (R6.1), PLD_Connectors_Piggyback (Piggyback_H1.13)
Piggyback_SPI-MISO_PE6: PLD Top/Flash Memory 3 (Flash_R1_Flash_Memory_3.5), PLD Top/FRAM Memory 1 (FRAM_R1_FRAM_Memory_1.5), PLD Top/Flash Memory 2 (Flash_R1_Flash_Memory_2.5), PLD Top/Flash Memory 1 (Flash_R1_Flash_Memory_1.5), PLD Top/FRAM Memory 2 (FRAM_R1_FRAM_Memory_2.5), PLD Top/FRAM Memory 3 (FRAM_R1_FRAM_Memory_3.5), PLD_Connectors_Piggyback (Piggyback_H1.17)
Piggyback_SPI-MOSI_PE7: PLD Top/Flash Memory 3 (Flash_R1_Flash_Memory_3.8), PLD Top/FRAM Memory 1 (FRAM_R1_FRAM_Memory_1.8), PLD Top/Flash Memory 2 (Flash_R1_Flash_Memory_2.8), PLD Top/Flash Memory 1 (Flash_R1_Flash_Memory_1.8), PLD Top/FRAM Memory 2 (FRAM_R1_FRAM_Memory_2.8), PLD Top/FRAM Memory 3 (FRAM_R1_FRAM_Memory_3.8), PLD_Connectors_Piggyback (Piggyback_H1.15)
Piggyback_UART-RX_PF7: PLD_CAM_MUX (MUX_R7.2), PLD_Connectors_Piggyback (Piggyback_H1.7)
Piggyback_UART-TX_PF6: PLD_CAM_MUX (MUX_R6.2), PLD_Connectors_Piggyback (Piggyback_H1.9)
SCL: AVR (AVR_U1.19), PLD Top/I2C_SW_AVR (I2C_SW_R2_I2C_SW_AVR.2 I2C_SW_S1_I2C_SW_AVR.3)
SDA: AVR (AVR_U1.20), PLD Top/I2C_SW_AVR (I2C_SW_R1_I2C_SW_AVR.2 I2C_SW_S1_I2C_SW_AVR.1)